# EAGLE board dt (EAGLE 9.6.2)
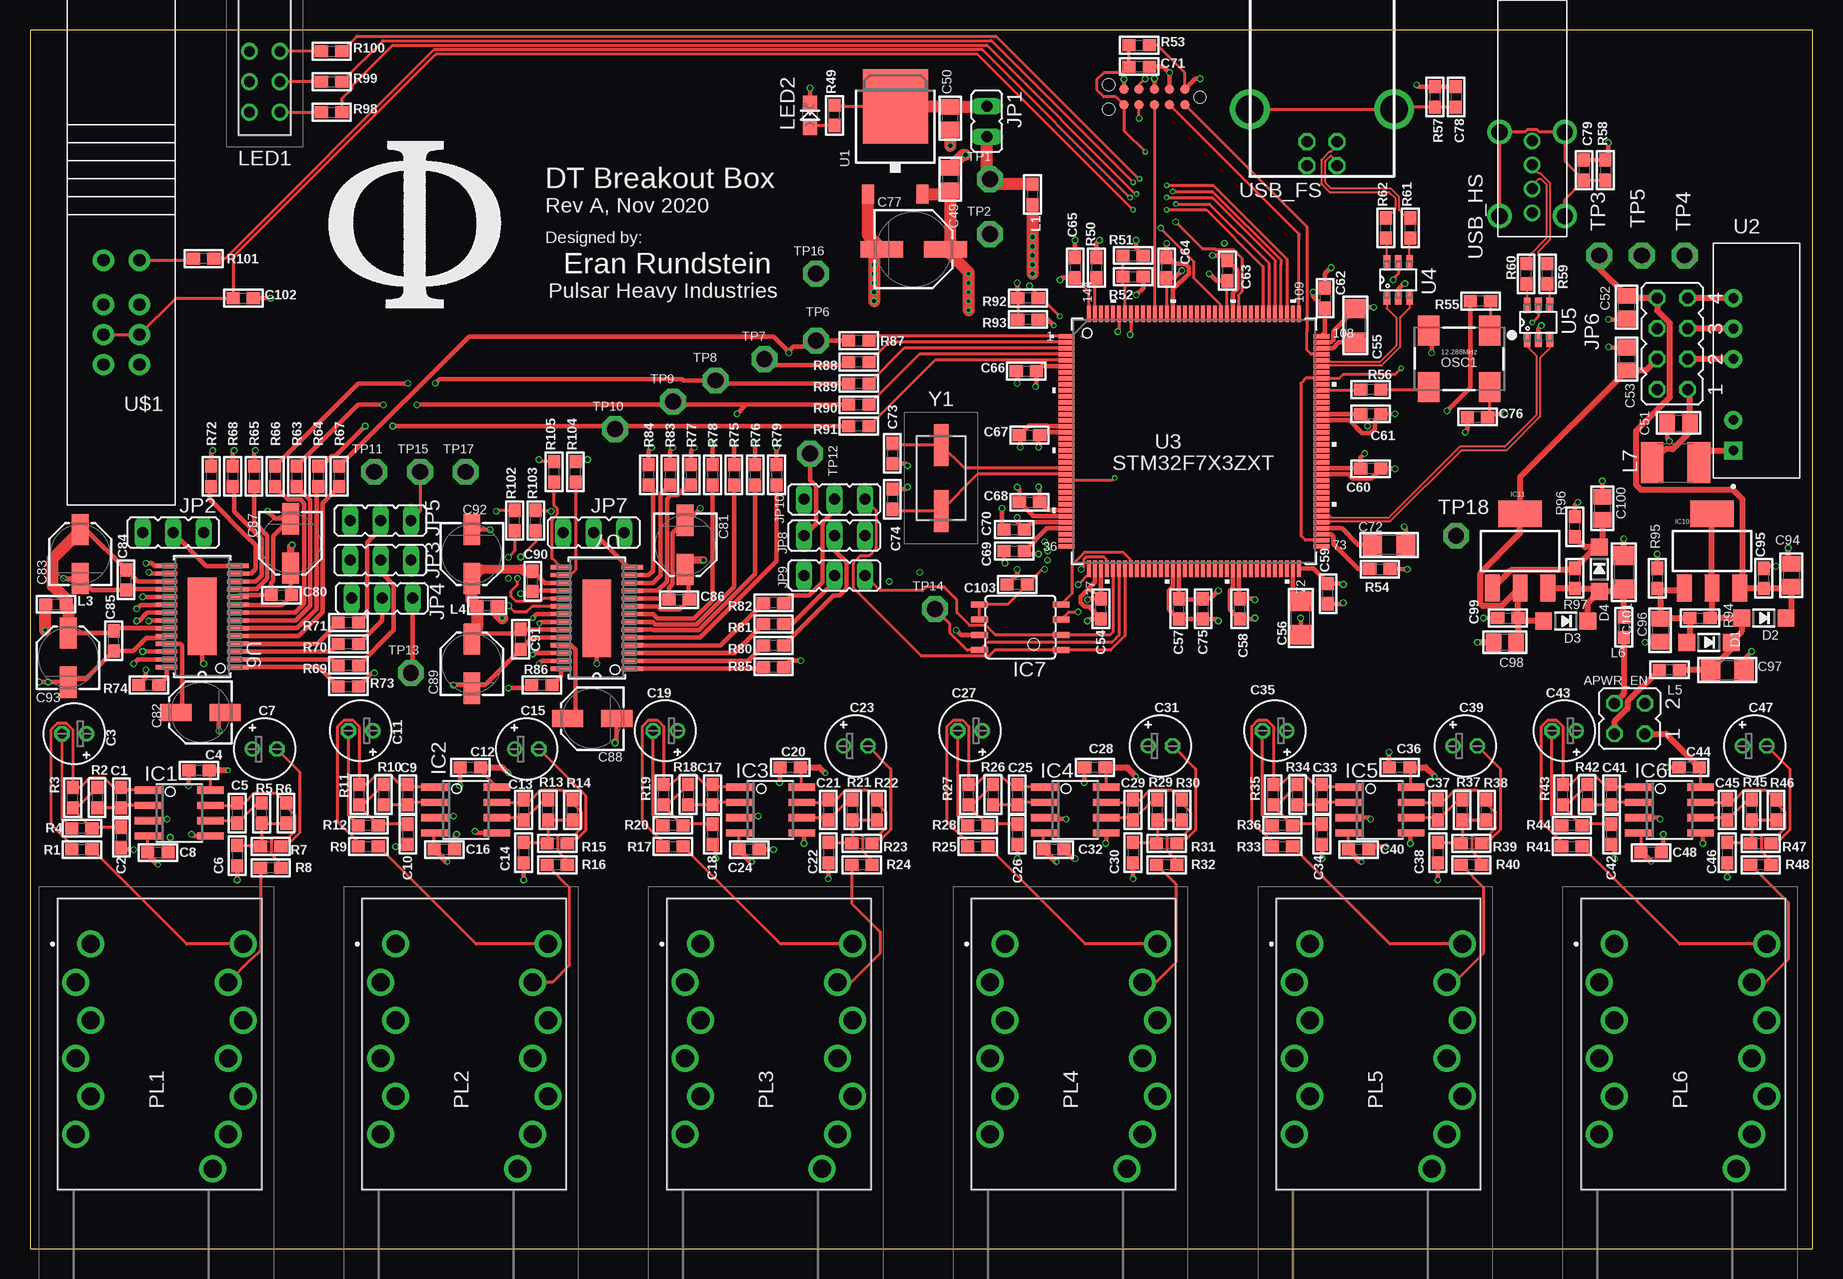
[diagram p4: board, top side]
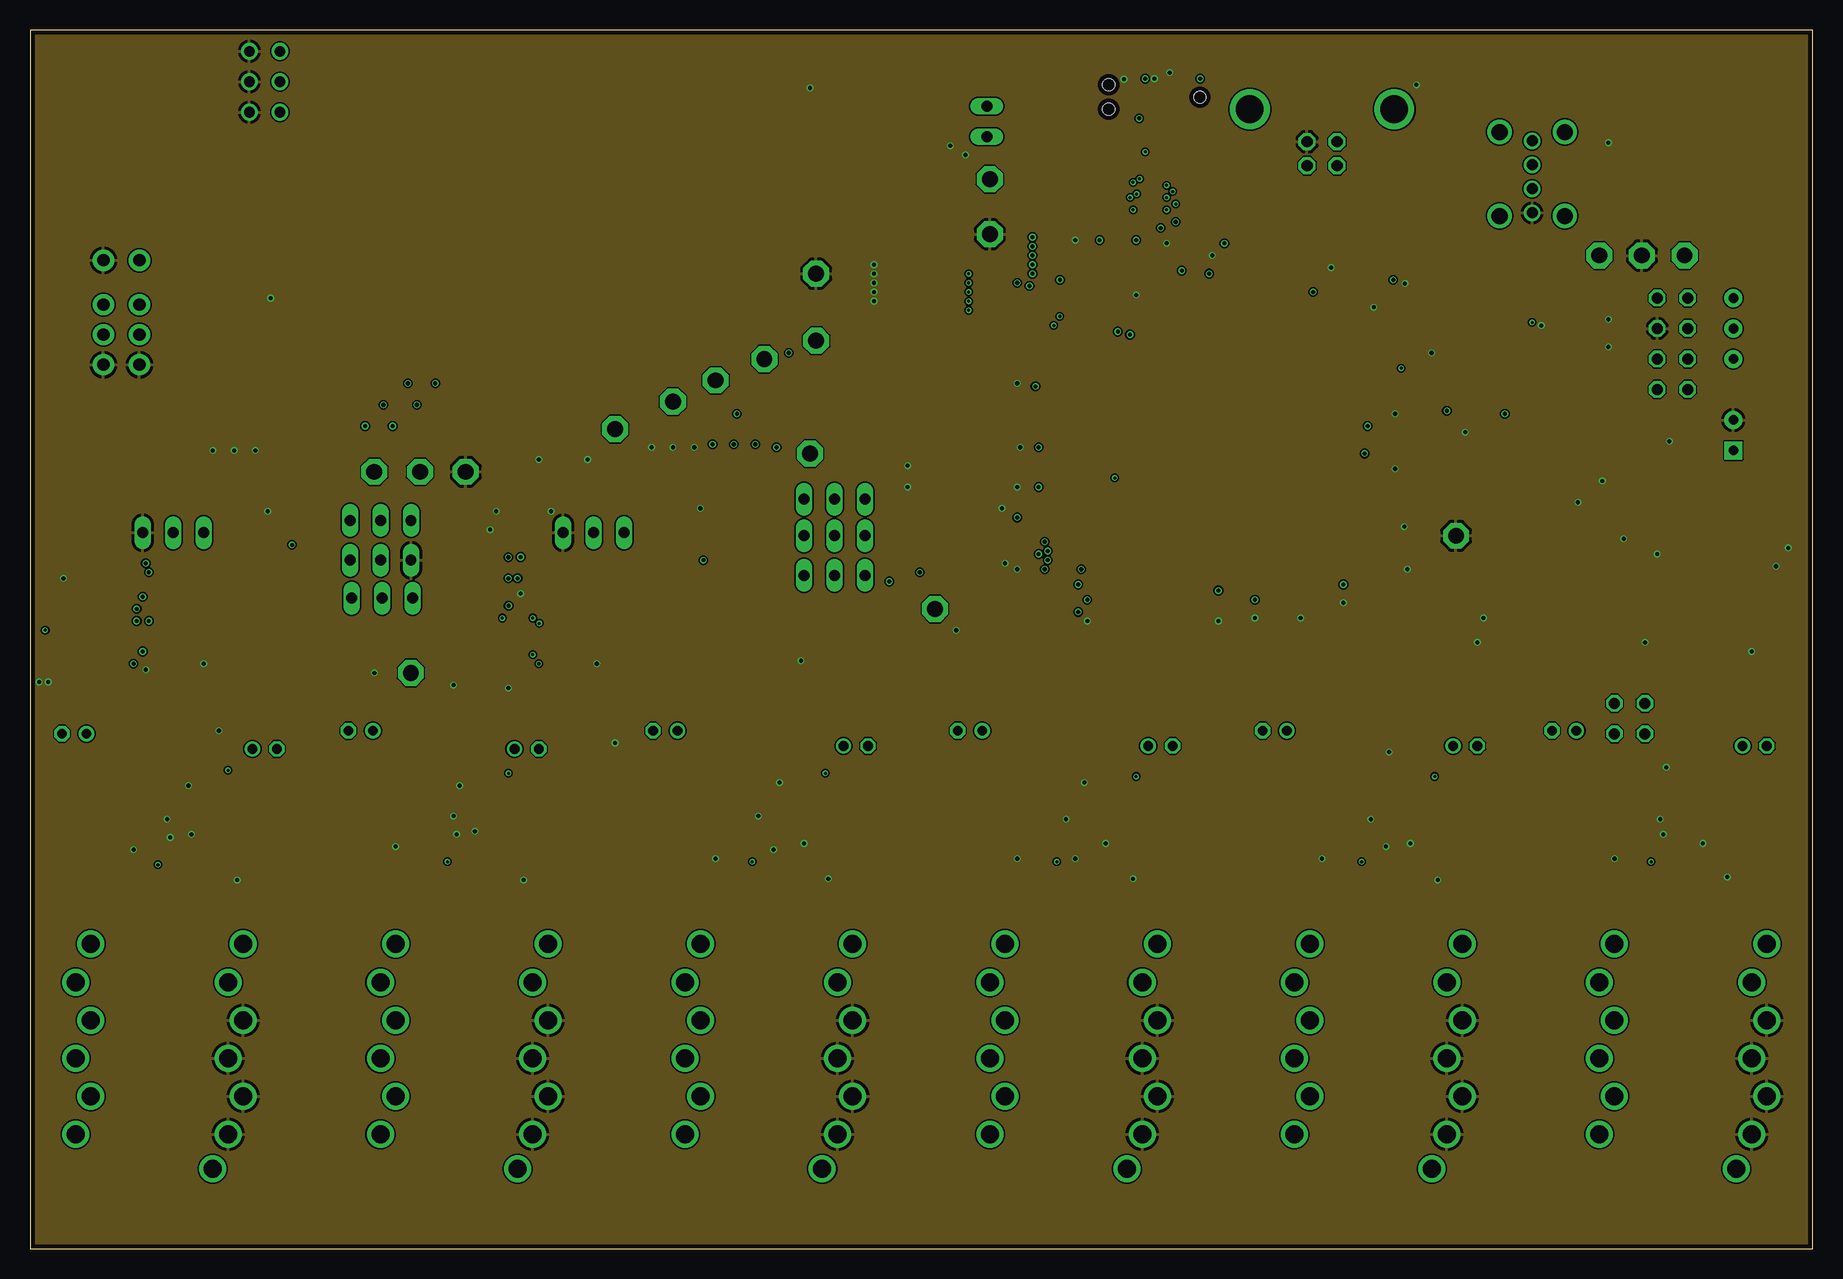
[diagram p5: board, inner layer Route2]
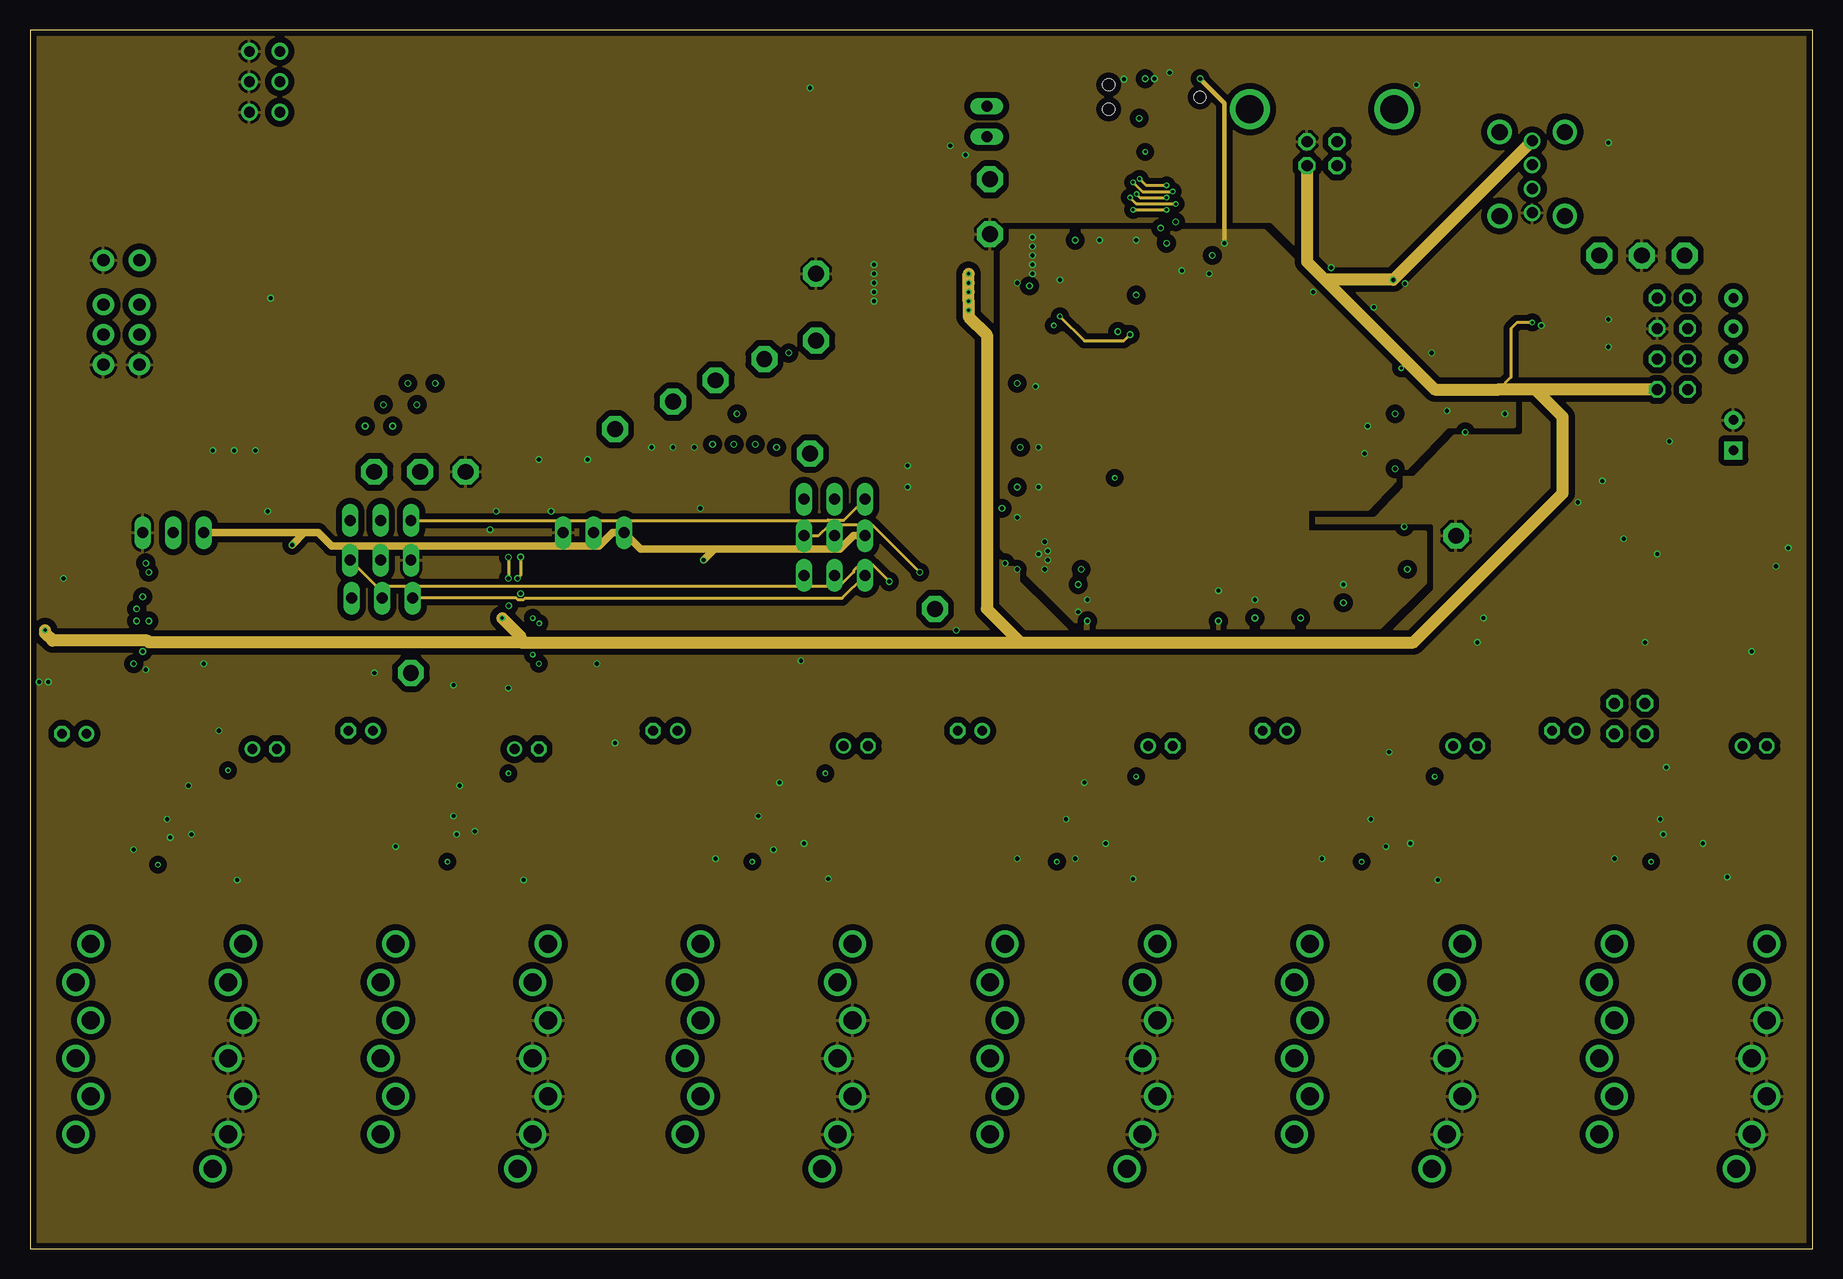
[diagram p6: board, inner layer Route15]
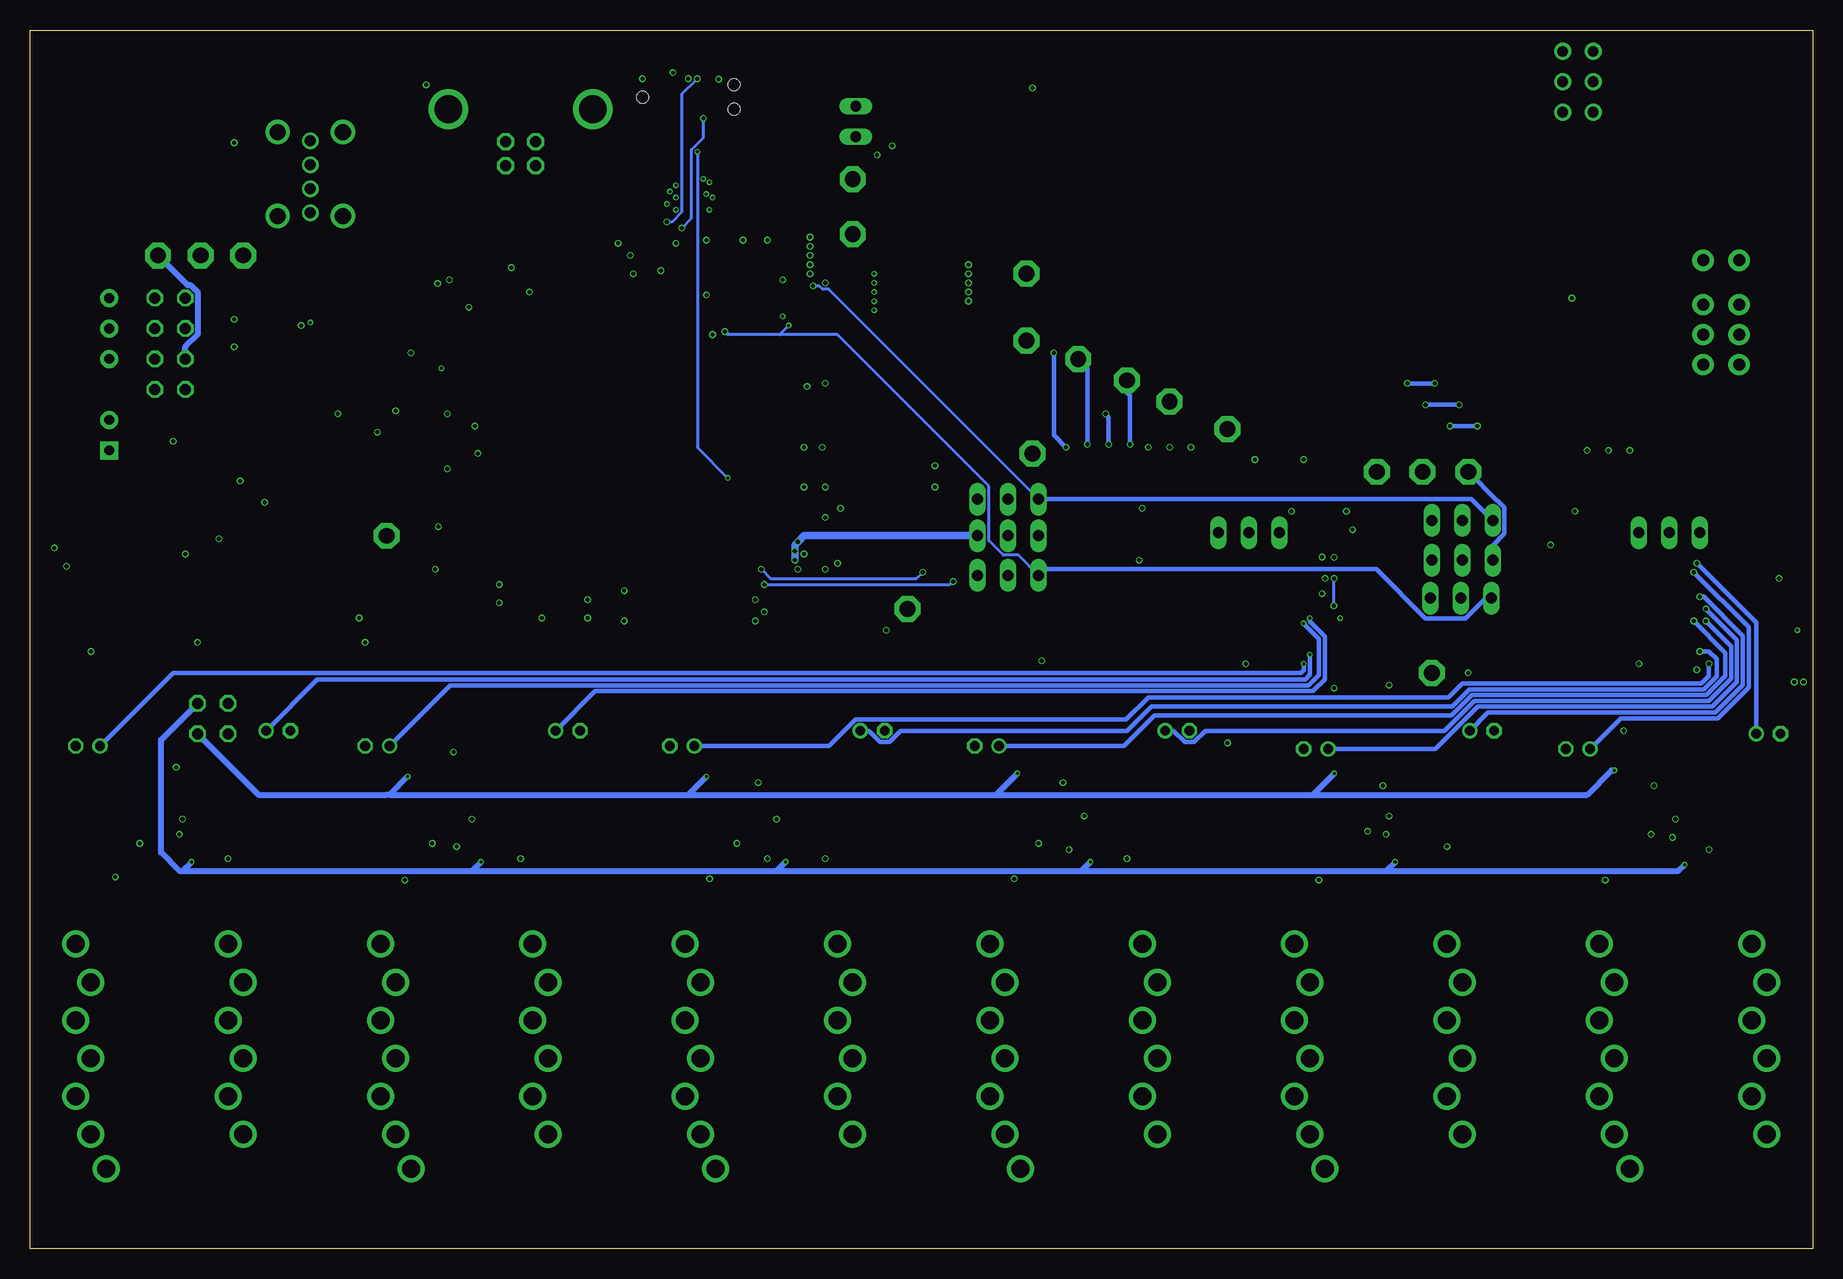
[diagram p7: board, bottom side, seen from below]

Size 148.59 x 101.6 mm. Coordinates in mm from the lower left corner, seen from the top.
Outline: 0,0 148.59,0 148.59,101.6 0,101.6 0,0
Copper layers (1+2*15+16): Top 0.035559375mm / dielectric 0.17018125mm / Route2 0.01778125mm / dielectric 47mil / Route15 0.01778125mm / dielectric 0.17018125mm / Bottom 0.035559375mm
Design rules "oshpark-4layer *": minimum track width 5mil, minimum drill 10mil, track to track 5mil, track to pad 5mil, pad to pad 5mil, via to via 5mil, smd to smd 5mil, copper to edge 15mil, drill to drill 6mil, minimum pad ring 4mil, minimum via ring 4mil, stop-mask expansion 1.5mil, vias tented up to drill 20mil, thermal gap 10mil
Net classes: 1 USB: width 0.152 mm, clearance 0.152 mm

## Footprints (pad centres in the part's own frame; a part is rotated, then mirrored left to right if it is on the bottom)
JP2Q = drill 0.914 octagon: 1 -1.27,-1.27; 2 -1.27,1.27; 3 1.27,-1.27; 4 1.27,1.27
0603 = smd 1.1 x 1: 1 -0.85,0; 2 0.85,0
E2-5 = drill 0.813 pad 1.27: + -1.016,0 | drill 0.813 pad 1.27 octagon: - 1.016,0
0805 = smd 1.3 x 1.5: 1 -0.95,0; 2 0.95,0
1206 = smd 1.6 x 1.8: 1 -1.4,0; 2 1.4,0
PANASONIC_D = smd 3.556 x 1.4: + 2.654,0; - -2.654,0
PANASONIC_C = smd 2.6 x 1.4: + 2.05,0; - -2.05,0
SOD-123 = smd 1.4 x 1.4: A 1.85,0; C -1.85,0
SO08 = smd 0.6 x 2.2: 1 -1.905,-2.6; 2 -0.635,-2.6; 3 0.635,-2.6; 4 1.905,-2.6; 5 1.905,2.6; 6 0.635,2.6; 7 -0.635,2.6; 8 -1.905,2.6
SOIC8 = smd 0.5 x 1.4: 1 -1.905,-3.404; 2 -0.645,-3.404; 3 0.625,-3.404; 4 1.895,-3.404; 5 1.905,3.404; 6 0.635,3.404; 7 -0.635,3.404; 8 -1.905,3.404
SOT223 = smd 1.219 x 2.235: 1 -2.311,-3.099; 2 0,-3.099; 3 2.311,-3.099 | smd 3.6 x 2.2: 4 0,3.099
JP1 = drill 0.914 long: 1 0,-1.27; 2 0,1.27
JP2 = drill 0.914 long: 1 -2.54,0; 2 0,0; 3 2.54,0
JP4Q = drill 0.914 octagon: 1 -3.81,-1.27; 2 -3.81,1.27; 3 -1.27,-1.27; 4 -1.27,1.27; 5 1.27,-1.27; 6 1.27,1.27; 7 3.81,-1.27; 8 3.81,1.27
L1812 = smd 1.9 x 3.4: 1 -1.95,0; 2 1.95,0
WP934SALILYLGD = drill 0.889 pad 1.4: A1 5.08,2.54; A2 2.54,2.54; A3 0,2.54; C1 5.08,0; C2 2.54,0; C3 0,0
CHIPLED_0805 = smd 1.2 x 1.2: A 0,-1.05; C 0,1.05
OSC_7X5MM = smd 1.8 x 2.5: 1 -2.54,-2.35; 2 2.54,-2.35; 3 2.54,2.35; 4 -2.54,2.35
NSJ12HF1 = drill 1.5 pad 2.25: 1 0,0; 2 3.18,-1.27; 3 6.35,0; 4 9.53,-1.27; 5 12.7,0; 6 15.874,-1.27; 7 18.75,10.16; 8 15.874,11.43; 9 12.7,12.7; 10 9.53,11.43; 11 6.35,12.7; 12 3.18,11.43; 13 0,12.7
TC2050-IDC-NL = smd 0.787 x 0.787: 1 -2.54,-0.635; 2 -2.54,0.635; 3 -1.27,-0.635; 4 -1.27,0.635; 5 0,-0.635; 6 0,0.635; 7 1.27,-0.635; 8 1.27,0.635; 9 2.54,-0.635; 10 2.54,0.635 | hole 0.991: -3.81,0; 3.81,1.016; 3.81,-1.016
P1-13 = drill 1.321 pad 2.159 octagon: TP 0,0
TO252 = smd 1 x 1.6: 1 -2.28,-4.8; 2 2.28,-4.8 | smd 5.4 x 6.2: 3 0,2.5
CONV_PCN2-S5-D12-S = drill 0.8 pad 1.5 square: 1 0,0 | drill 0.8 pad 1.5: 2 2.54,0; 4 7.62,0; 5 10.16,0; 6 12.7,0
LQFP144-20X20MM = smd 1.346 x 0.356: 1 -10.625,8.75; 2 -10.625,8.25; 3 -10.625,7.75; 4 -10.625,7.25; 5 -10.625,6.75; 6 -10.625,6.25; 7 -10.625,5.75; 8 -10.625,5.25; 9 -10.625,4.75; 10 -10.625,4.25; 11 -10.625,3.75; 12 -10.625,3.25; 13 -10.625,2.75; 14 -10.625,2.25; 15 -10.625,1.75; 16 -10.625,1.25; 17 -10.625,0.75; 18 -10.625,0.25; 19 -10.625,-0.25; 20 -10.625,-0.75; 21 -10.625,-1.25; 22 -10.625,-1.75; 23 -10.625,-2.25; 24 -10.625,-2.75; 25 -10.625,-3.25; 26 -10.625,-3.75; 27 -10.625,-4.25; 28 -10.625,-4.75; 29 -10.625,-5.25; 30 -10.625,-5.75; 31 -10.625,-6.25; 32 -10.625,-6.75; 33 -10.625,-7.25; 34 -10.625,-7.75; 35 -10.625,-8.25; 36 -10.625,-8.75; 73 10.625,-8.75; 74 10.625,-8.25; 75 10.625,-7.75; 76 10.625,-7.25; 77 10.625,-6.75; 78 10.625,-6.25; 79 10.625,-5.75; 80 10.625,-5.25; 81 10.625,-4.75; 82 10.625,-4.25; 83 10.625,-3.75; 84 10.625,-3.25; 85 10.625,-2.75; 86 10.625,-2.25; 87 10.625,-1.75; 88 10.625,-1.25; 89 10.625,-0.75; 90 10.625,-0.25; 91 10.625,0.25; 92 10.625,0.75; 93 10.625,1.25; 94 10.625,1.75; 95 10.625,2.25; 96 10.625,2.75; 97 10.625,3.25; 98 10.625,3.75; 99 10.625,4.25; 100 10.625,4.75; 101 10.625,5.25; 102 10.625,5.75; 103 10.625,6.25; 104 10.625,6.75; 105 10.625,7.25; 106 10.625,7.75; 107 10.625,8.25; 108 10.625,8.75 | smd 0.356 x 1.346: 37 -8.75,-10.625; 38 -8.25,-10.625; 39 -7.75,-10.625; 40 -7.25,-10.625; 41 -6.75,-10.625; 42 -6.25,-10.625; 43 -5.75,-10.625; 44 -5.25,-10.625; 45 -4.75,-10.625; 46 -4.25,-10.625; 47 -3.75,-10.625; 48 -3.25,-10.625; 49 -2.75,-10.625; 50 -2.25,-10.625; 51 -1.75,-10.625; 52 -1.25,-10.625; 53 -0.75,-10.625; 54 -0.25,-10.625; 55 0.25,-10.625; 56 0.75,-10.625; 57 1.25,-10.625; 58 1.75,-10.625; 59 2.25,-10.625; 60 2.75,-10.625; 61 3.25,-10.625; 62 3.75,-10.625; 63 4.25,-10.625; 64 4.75,-10.625; 65 5.25,-10.625; 66 5.75,-10.625; 67 6.25,-10.625; 68 6.75,-10.625; 69 7.25,-10.625; 70 7.75,-10.625; 71 8.25,-10.625; 72 8.75,-10.625; 109 8.75,10.625; 110 8.25,10.625; 111 7.75,10.625; 112 7.25,10.625; 113 6.75,10.625; 114 6.25,10.625; 115 5.75,10.625; 116 5.25,10.625; 117 4.75,10.625; 118 4.25,10.625; 119 3.75,10.625; 120 3.25,10.625; 121 2.75,10.625; 122 2.25,10.625; 123 1.75,10.625; 124 1.25,10.625; 125 0.75,10.625; 126 0.25,10.625; 127 -0.25,10.625; 128 -0.75,10.625; 129 -1.25,10.625; 130 -1.75,10.625; 131 -2.25,10.625; 132 -2.75,10.625; 133 -3.25,10.625; 134 -3.75,10.625; 135 -4.25,10.625; 136 -4.75,10.625; 137 -5.25,10.625; 138 -5.75,10.625; 139 -6.25,10.625; 140 -6.75,10.625; 141 -7.25,10.625; 142 -7.75,10.625; 143 -8.25,10.625; 144 -8.75,10.625
SOT23-6L_STM-M = smd 1.181 x 0.559: 1 -1.467,0.95; 2 -1.467,0; 3 -1.467,-0.95; 4 1.467,-0.95; 5 1.467,0; 6 1.467,0.95
PWP28_6P46X2P4-M = smd 1.778 x 0.356: 1 -2.972,4.225; 2 -2.972,3.575; 3 -2.972,2.925; 4 -2.972,2.275; 5 -2.972,1.625; 6 -2.972,0.975; 7 -2.972,0.325; 8 -2.972,-0.325; 9 -2.972,-0.975; 10 -2.972,-1.625; 11 -2.972,-2.275; 12 -2.972,-2.925; 13 -2.972,-3.575; 14 -2.972,-4.225; 15 2.972,-4.225; 16 2.972,-3.575; 17 2.972,-2.925; 18 2.972,-2.275; 19 2.972,-1.625; 20 2.972,-0.975; 21 2.972,-0.325; 22 2.972,0.325; 23 2.972,0.975; 24 2.972,1.625; 25 2.972,2.275; 26 2.972,2.925; 27 2.972,3.575; 28 2.972,4.225 | smd 2.4 x 6.46: 29 0,0
WBL2UOAGQ = drill 1.016 pad 1.778: LED+ -6.2,1.5; LED- -6.2,-1.5; P$1 -2.5,-1.5; P$2 0,-1.5; P$3 2.5,-1.5; P$4 -2.5,1.5; P$5 0,1.5; P$6 2.5,1.5
TE-292304-1 = drill 0.95 octagon: 1 1.25,4.71; 2 -1.25,4.71; 3 -1.25,2.71; 4 1.25,2.71 | drill 2.3: P$1 6.02,0; P$2 -6.02,0
FCI-73725-0110BLF = drill 1.35: M1 -2.72,-6.73; M2 2.72,0.27; M3 -2.72,0.27; M4 2.72,-6.73 | drill 0.92: P$1 0,-6; P$2 0,-4; P$3 0,-2; P$4 0,0
ABLS7M225000MHZD2YT = smd 3.5 x 1.2: 1 -2.75,0; 2 2.75,0

## Placement (x,y rotation side)
APWR_EN  [JP2Q]  133.35,44.2 90 top
C1  470pF  [0603]  7.62,37.59 270 top
C2  4700pF  [0603]  7.62,34.29 270 top
C3  100u  [E2-5]  3.68,42.93 180 top
C4  100n  [0603]  14.1,39.88 180 top
C5  470pF  [0603]  17.27,36.32 270 top
C6  4700pF  [0603]  17.27,32.77 270 top
C7  100u  [E2-5]  19.56,41.66 0 top
C8  100n  [0603]  10.67,33.02 180 top
C9  470pF  [0603]  31.5,37.85 270 top
C10  4700pF  [0603]  31.5,34.54 270 top
C11  100u  [E2-5]  27.56,43.18 180 top
C12  100n  [0603]  36.7,40.13 180 top
C13  470pF  [0603]  41.15,36.58 270 top
C14  4700pF  [0603]  41.15,33.02 270 top
C15  100u  [E2-5]  41.4,41.66 0 top
C16  100n  [0603]  34.54,33.27 180 top
C17  470pF  [0603]  56.9,37.85 270 top
C18  4700pF  [0603]  56.9,34.54 270 top
C19  100u  [E2-5]  52.96,43.18 180 top
C20  100n  [0603]  63.37,40.13 180 top
C21  470pF  [0603]  66.55,36.58 270 top
C22  4700pF  [0603]  66.55,33.02 270 top
C23  100u  [E2-5]  68.83,41.91 0 top
C24  100n  [0603]  59.94,33.27 180 top
C25  470pF  [0603]  82.3,37.85 270 top
C26  4700pF  [0603]  82.3,34.54 270 top
C27  100u  [E2-5]  78.36,43.18 180 top
C28  100n  [0603]  88.77,40.13 180 top
C29  470pF  [0603]  91.95,36.58 270 top
C30  4700pF  [0603]  91.95,33.02 270 top
C31  100u  [E2-5]  94.23,41.91 0 top
C32  100n  [0603]  85.34,33.27 180 top
C33  470pF  [0603]  107.7,37.85 270 top
C34  4700pF  [0603]  107.7,34.54 270 top
C35  100u  [E2-5]  103.76,43.18 180 top
C36  100n  [0603]  114.17,40.13 180 top
C37  470pF  [0603]  117.35,36.58 270 top
C38  4700pF  [0603]  117.35,33.02 270 top
C39  100u  [E2-5]  119.63,41.91 0 top
C40  100n  [0603]  110.74,33.27 180 top
C41  470pF  [0603]  131.83,37.85 270 top
C42  4700pF  [0603]  131.83,34.54 270 top
C43  100u  [E2-5]  127.89,43.18 180 top
C44  100n  [0603]  138.3,40.13 180 top
C45  470pF  [0603]  141.48,36.58 270 top
C46  4700pF  [0603]  141.48,33.02 270 top
C47  100u  [E2-5]  143.76,41.91 0 top
C48  100n  [0603]  135.13,33.02 180 top
C49  10u  [0805]  76.71,89.15 270 top
C50  10u  [0805]  76.71,94.23 90 top
C51  10u  [0805]  137.41,68.83 0 top
C52  10u  [0805]  133.1,78.49 90 top
C53  10u  [0805]  133.1,74.17 270 top
C54  100n  [0603]  89.28,53.34 90 top
C55  2.2u  [1206]  110.49,76.96 270 top
C56  2.2u  [1206]  105.92,52.58 90 top
C57  100n  [0603]  95.76,53.34 90 top
C58  100n  [0603]  100.84,53.34 90 top
C59  100n  [0603]  108.2,54.61 90 top
C60  100n  [0603]  111.76,65.02 180 top
C61  100n  [0603]  111.76,69.6 180 top
C62  100n  [0603]  107.95,79.25 270 top
C63  100n  [0603]  99.82,81.53 270 top
C64  100n  [0603]  94.74,81.79 270 top
C65  100n  [0603]  87.12,81.79 270 top
C66  100n  [0603]  83.06,73.15 0 top
C67  100n  [0603]  83.31,67.82 0 top
C68  100n  [0603]  83.31,62.23 0 top
C69  100n  [0603]  82.04,58.17 0 top
C70  100n  [0603]  82.04,59.94 0 top
C71  100n  [0603]  92.46,98.55 0 top
C72  2.2u  [1206]  113.28,58.67 180 top
C73  18pF  [0603]  71.88,66.29 270 top
C74  18pF  [0603]  71.88,62.48 270 top
C75  4.7u  [0603]  97.79,53.34 90 top
C76  100n  [0603]  120.65,69.34 0 top
C77  100u  [PANASONIC_D]  73.66,83.31 0 top
C78  4700pF  [0603]  118.87,96.01 270 top
C79  4700pF  [0603]  129.54,89.92 270 top
C80  1u Ceramic  [0603]  20.95,54.48 0 top
C81  10u Electrolyte  [PANASONIC_C]  54.61,58.67 270 top
C82  10u Electrolyte  [PANASONIC_C]  14.22,44.7 180 top
C83  10u Electrolyte  [PANASONIC_C]  4.19,57.91 90 top
C84  1u Ceramic  [0603]  8,55.75 90 top
C85  1u Ceramic  [0603]  6.99,50.67 90 top
C86  1u Ceramic  [0603]  54.1,54.1 0 top
C87  10u Electrolyte  [PANASONIC_C]  21.72,58.8 270 top
C88  10u Electrolyte  [PANASONIC_C]  46.86,44.2 180 top
C89  10u Electrolyte  [PANASONIC_C]  36.83,48.77 90 top
C90  1u Ceramic  [0603]  41.91,55.63 90 top
C91  1u Ceramic  [0603]  40.89,50.8 90 top
C92  10u Electrolyte  [PANASONIC_C]  36.83,57.91 270 top
C93  10u Electrolyte  [PANASONIC_C]  3.17,49.28 90 top
C94  2.2u  [0805]  146.81,56.13 270 top
C95  100n  [0603]  144.53,55.88 90 top
C96  10u  [0805]  135.89,51.56 270 top
C97  1u  [1206]  141.48,48.26 0 top
C98  2.2u  [0805]  122.94,50.55 180 top
C99  100n  [0603]  123.19,52.58 0 top
C100  10u  [0805]  131.06,61.72 270 top
C101  1u  [1206]  132.84,56.39 270 top
C102  100n  [0603]  17.78,79.25 0 top
C103  100n  [0603]  82.3,55.37 180 top
D1  MBR120LSFT3G  [SOD-123]  139.95,50.55 180 top
D2  MBR120LSFT3G  [SOD-123]  144.53,52.58 180 top
D3  MBR120LSFT3G  [SOD-123]  128.02,52.32 180 top
D4  MBR120LSFT3G  [SOD-123]  130.81,56.64 270 top
IC1  TL072D  [SO08]  12.45,36.32 270 top
IC2  TL072D  [SO08]  36.32,36.58 270 top
IC3  TL072D  [SO08]  61.72,36.58 270 top
IC4  TL072D  [SO08]  87.12,36.58 270 top
IC5  TL072D  [SO08]  112.52,36.58 270 top
IC6  TL072D  [SO08]  136.65,36.58 270 top
IC7  AT45DB161D-SU  [SOIC8]  82.55,51.82 90 top
IC10  LM317  [SOT223]  140.21,58.17 0 top
IC11  LM337  [SOT223]  124.21,58.17 0 top
JP1  [JP1]  79.76,93.98 180 top
JP2  [JP2]  11.94,59.69 0 top
JP3  [JP2]  29.21,57.4 0 top
JP4  [JP2]  29.34,54.23 180 top
JP5  [JP2]  29.21,60.71 180 top
JP6  [JP4Q]  136.91,75.44 90 top
JP7  [JP2]  46.99,59.69 0 top
JP8  [JP2]  67.06,59.44 0 top
JP9  [JP2]  67.06,56.13 180 top
JP10  [JP2]  67.06,62.48 180 top
L1  600ohm @ 100MHz  [0603]  83.57,87.88 270 top
L3  600ohm @ 100MHz  [0603]  2.16,53.72 0 top
L4  600ohm @ 100MHz  [0603]  38.1,53.59 180 top
L5  600ohm @ 100MHz  [0603]  136.65,48.26 180 top
L6  600ohm @ 100MHz  [0603]  132.84,51.82 270 top
L7  5.6uH  [L1812]  137.16,65.53 0 top
LED1  WP934SA_LILYLGDLED  [WP934SALILYLGD]  18.29,99.82 270 top
LED2  [CHIPLED_0805]  65.02,94.49 0 top
OSC1  12.288MHz  [OSC_7X5MM]  119.13,74.17 180 top
PL1  NSJ12HC  [NSJ12HF1]  5.08,25.4 270 top
PL2  NSJ12HC  [NSJ12HF1]  30.48,25.4 270 top
PL3  NSJ12HC  [NSJ12HF1]  55.88,25.4 270 top
PL4  NSJ12HC  [NSJ12HF1]  81.28,25.4 270 top
PL5  NSJ12HC  [NSJ12HF1]  106.68,25.4 270 top
PL6  NSJ12HC  [NSJ12HF1]  132.08,25.4 270 top
R1  47  [0603]  4.32,33.27 0 top
R2  560  [0603]  5.59,37.59 270 top
R3  8.2k  [0603]  3.56,37.59 90 top
R4  5.1k  [0603]  4.32,35.05 180 top
R5  560  [0603]  19.3,36.32 90 top
R6  8.2k  [0603]  21.34,36.32 90 top
R7  5.1k  [0603]  20.07,33.53 0 top
R8  47  [0603]  20.07,31.75 180 top
R9  47  [0603]  28.19,33.53 0 top
R10  560  [0603]  29.46,37.85 270 top
R11  8.2k  [0603]  27.43,37.85 90 top
R12  5.1k  [0603]  28.19,35.31 180 top
R13  560  [0603]  43.18,36.58 90 top
R14  8.2k  [0603]  45.21,36.58 90 top
R15  5.1k  [0603]  43.94,33.78 0 top
R16  47  [0603]  43.94,32 180 top
R17  47  [0603]  53.59,33.53 0 top
R18  560  [0603]  54.86,37.85 270 top
R19  8.2k  [0603]  52.83,37.85 90 top
R20  5.1k  [0603]  53.59,35.31 180 top
R21  560  [0603]  68.58,36.58 90 top
R22  8.2k  [0603]  70.61,36.58 90 top
R23  5.1k  [0603]  69.34,33.78 0 top
R24  47  [0603]  69.34,32 180 top
R25  47  [0603]  78.99,33.53 0 top
R26  560  [0603]  80.26,37.85 270 top
R27  8.2k  [0603]  78.23,37.85 90 top
R28  5.1k  [0603]  78.99,35.31 180 top
R29  560  [0603]  93.98,36.58 90 top
R30  8.2k  [0603]  96.01,36.58 90 top
R31  5.1k  [0603]  94.74,33.78 0 top
R32  47  [0603]  94.74,32 180 top
R33  47  [0603]  104.39,33.53 0 top
R34  560  [0603]  105.66,37.85 270 top
R35  8.2k  [0603]  103.63,37.85 90 top
R36  5.1k  [0603]  104.39,35.31 180 top
R37  560  [0603]  119.38,36.58 90 top
R38  8.2k  [0603]  121.41,36.58 90 top
R39  5.1k  [0603]  120.14,33.78 0 top
R40  47  [0603]  120.14,32 180 top
R41  47  [0603]  128.52,33.53 0 top
R42  560  [0603]  129.79,37.85 270 top
R43  8.2k  [0603]  127.76,37.85 90 top
R44  5.1k  [0603]  128.52,35.31 180 top
R45  560  [0603]  143.51,36.58 90 top
R46  8.2k  [0603]  145.54,36.58 90 top
R47  5.1k  [0603]  144.27,33.78 0 top
R48  47  [0603]  144.27,32 180 top
R49  1k  [0603]  67.06,94.49 90 top
R50  10k  [0603]  88.9,81.79 270 top
R51  10k  [0603]  91.95,82.8 0 top
R52  10k  [0603]  91.95,81.03 0 top
R53  10k  [0603]  92.46,100.33 0 top
R54  3k 1%  [0603]  112.52,56.64 0 top
R55  10k  [0603]  120.9,78.99 180 top
R56  0  [0603]  111.76,71.63 180 top
R57  1M  [0603]  117.09,96.01 270 top
R58  1M  [0603]  131.32,89.92 270 top
R59  0  [0603]  126.49,81.28 90 top
R60  0  [0603]  124.71,81.28 90 top
R61  0  [0603]  115.06,85.09 90 top
R62  0  [0603]  113.03,85.09 90 top
R63  0  [0603]  22.23,64.39 270 top
R64  0  [0603]  24,64.39 270 top
R65  22  [0603]  18.67,64.39 270 top
R66  0  [0603]  20.45,64.39 270 top
R67  0  [0603]  25.78,64.39 270 top
R68  22  [0603]  16.89,64.39 270 top
R69  0  [0603]  26.54,48.64 180 top
R70  0  [0603]  26.54,50.42 180 top
R71  0  [0603]  26.54,52.2 180 top
R72  22  [0603]  15.11,64.39 270 top
R73  22  [0603]  26.54,46.86 0 top
R74  22  [0603]  9.91,46.99 180 top
R75  0  [0603]  58.67,64.52 270 top
R76  0  [0603]  60.45,64.52 270 top
R77  22  [0603]  55.12,64.52 270 top
R78  0  [0603]  56.9,64.52 270 top
R79  0  [0603]  62.23,64.52 270 top
R80  0  [0603]  61.98,50.29 180 top
R81  0  [0603]  61.98,52.07 180 top
R82  0  [0603]  61.98,53.85 180 top
R83  22  [0603]  53.34,64.52 270 top
R84  22  [0603]  51.56,64.52 270 top
R85  22  [0603]  61.98,48.51 0 top
R86  22  [0603]  42.67,46.99 180 top
R87  22  [0603]  69.09,75.69 180 top
R88  22  [0603]  69.09,73.91 180 top
R89  22  [0603]  69.09,72.14 180 top
R90  22  [0603]  69.09,70.36 180 top
R91  22  [0603]  69.09,68.58 180 top
R92  4.7k  [0603]  83.19,79.25 180 top
R93  4.7k  [0603]  83.19,77.47 180 top
R94  240 0.1%  [0603]  139.19,52.58 0 top
R95  2.2k 0.1%  [0603]  135.64,55.88 270 top
R96  2.2k 0.1%  [0603]  128.78,60.2 90 top
R97  240 0.1%  [0603]  128.78,55.88 90 top
R98  1k  [0603]  25.15,94.74 0 top
R99  1k  [0603]  25.15,97.28 0 top
R100  1k  [0603]  25.15,99.82 0 top
R101  1k  [0603]  14.48,82.55 180 top
R102  1k  [0603]  40.39,60.71 90 top
R103  1k  [0603]  42.16,60.71 90 top
R104  1k  [0603]  45.47,64.77 90 top
R105  1k  [0603]  43.69,64.77 90 top
TC1  TC2050-IDC-NL  [TC2050-IDC-NL]  93.73,96.01 180 top
TP1  TPPAD1-13  [P1-13]  80.01,89.15 0 top
TP2  TPPAD1-13  [P1-13]  80.01,84.58 0 top
TP3  TPPAD1-13  [P1-13]  130.81,82.8 90 top
TP4  TPPAD1-13  [P1-13]  137.92,82.8 90 top
TP5  TPPAD1-13  [P1-13]  134.37,82.8 90 top
TP6  TPPAD1-13  [P1-13]  65.53,75.69 0 top
TP7  TPPAD1-13  [P1-13]  61.21,74.17 0 top
TP8  TPPAD1-13  [P1-13]  57.15,72.39 0 top
TP9  TPPAD1-13  [P1-13]  53.59,70.61 0 top
TP10  TPPAD1-13  [P1-13]  48.77,68.33 0 top
TP11  TPPAD1-13  [P1-13]  28.7,64.77 0 top
TP12  TPPAD1-13  [P1-13]  65.02,66.29 0 top
TP13  TPPAD1-13  [P1-13]  31.75,48.01 0 top
TP14  TPPAD1-13  [P1-13]  75.44,53.34 0 top
TP15  TPPAD1-13  [P1-13]  32.51,64.77 0 top
TP16  TPPAD1-13  [P1-13]  65.53,81.28 0 top
TP17  TPPAD1-13  [P1-13]  36.32,64.77 0 top
TP18  TPPAD1-13  [P1-13]  118.87,59.44 0 top
U1  LM1117DTX-3.3  [TO252]  72.14,92.71 0 top
U2  PCN2-S5-D15-S  [CONV_PCN2-S5-D12-S]  141.99,66.55 90 top
U3  STM32F7X3ZXT  [LQFP144-20X20MM]  97.03,67.31 0 top
U4  USBLC6-2SC6YSOT23-6L_STM-M  [SOT23-6L_STM-M]  114.05,80.77 90 top
U5  USBLC6-2SC6YSOT23-6L_STM-M  [SOT23-6L_STM-M]  125.73,77.22 90 top
U6  PCM1681PWPPWP28_6P46X2P4-M  [PWP28_6P46X2P4-M]  14.35,52.7 180 top
U7  PCM1681PWPPWP28_6P46X2P4-M  [PWP28_6P46X2P4-M]  47.24,52.58 180 top
U$1  WBL2UOAGQR05CLR  [WBL2UOAGQ]  7.62,76.2 270 top
U$2  PHI-LOGO  [PHI-LOGO]  32.51,86.11 90 top
USB_FS  [TE-292304-1]  107.7,95 180 top
USB_HS  FCI-73725-0110BLF  [FCI-73725-0110BLF]  125.22,86.36 180 top
Y1  ABLS7M2-25.000MHZ-D2Y-T  [ABLS7M225000MHZD2YT]  75.95,64.26 270 top

## Tracks (layer width: path | path; a pad name or v marks a point on that pad's centre or on a via)
+3V3  (via drill 0.35)
  Top 0.254: U3.121 99.78,80.64 C63.2 | U3.131 94.78,80.9 C64.2 | U3.144 88.28,79.78 C65.2 | TC1.1 96.27,98.04 93.98,100.33 R53.2 | OSC1.4 121.67,69.51 C76.2 | R92.2 R93.2 | IC7.6 IC7.5 81.5,53.72 C103.1 84.42,56.64 v84.58,56.64 | IC7.3 86.6,53.09 v87.38,53.09
  Top 0.356: C64.2 95.42,80.94 v96.01,81.53 | C63.2 98.89,80.68 v98.3,81.28 | v106.96,79.76 106.93,79.73 106.93,79.41 C62.2 107.95,76.36 U3.108 | R51.2 92.2,83.4 v92.2,84.07 | R50.1 88.9,83.82 v89.15,84.07 | C65.2 86.02,80.94 v85.85,80.77 | R92.2 82.3,79.29 v82.3,80.52 | U3.6 84.32,73.56 C66.2 83.91,71.97 v83.82,71.88 | U3.17 84.4,68.06 C67.2 84.07,67.73 v84.07,66.8 | U3.30 84.83,61.56 C68.2 84.16,63.41 v84.07,63.5 | U3.32 83.51,60.56 C70.2 82.3,60.54 v82.3,60.96 | U3.33 84.79,60.06 C69.2 83.15,57.91 v84.07,57.91 | U3.39 C54.2 88.23,54.19 v88.14,54.1 | U3.52 95.78,54.21 | 95.78,54.21 C57.2 | U3.62 100.78,54.25 C58.2 102.02,54.19 v102.11,54.1 | 95.78,54.21 95.89,54.1 97.7,54.1 C75.2 98.39,54.19 v99.06,54.86 | U3.72 106.98,56.69 C59.2 109.39,55.46 v109.47,55.37 | U3.86 110.87,65.06 C60.2 110.91,65.95 v111.25,66.29 | U3.95 107.67,69.58 108.45,69.58 108.47,69.6 C61.2 111.51,69 v111.51,68.58 | C76.2 121.75,69.6 v122.94,69.6 | R55.2 120.05,71.79 v118.11,69.85 | TC1.1 97.16,97.54 v97.54,97.54 | U6.9 19.43,53.68 21,53.68 C80.2 21.72,54.57 C87.+ | U7.9 52.32,53.55 52.58,53.3 54.15,53.3 C86.2 54.88,54.17 54.88,56.9 54.88,57.4
  Top 0.61: C81.+ 54.88,56.9 | 54.88,57.4 v56.13,57.4 | C87.+ 21.72,58.55 v21.84,58.67
  Top 1.016: L1.2 v83.57,84.33 v83.57,83.57 v83.57,82.8 v83.57,82.04 v83.57,81.28
  Route15 0.356: v97.54,97.54 99.57,95.5 v99.57,83.82
  Route15 0.61: JP8.3 68.64,59.44 67.52,58.32 57.05,58.32 | 57.05,58.32 50.9,58.32 JP7.3 48.57,59.69 47.45,58.57 25.15,58.57 24.03,59.69 22.86,59.69 | v56.13,57.4 57.05,58.32 | JP2.3 22.86,59.69 | v21.84,58.67 22.86,59.69
  Bottom 0.61: JP8.3 84.07,59.44 v84.58,58.93 84.84,58.67 v84.84,58.17 v84.84,57.4
  pour Route15 (isolate 0.508): 81.03,84.84 81.03,58.42 87.63,51.82 112.52,51.82 116.25,55.55 116.25,59.69 106.43,59.69 106.43,61.72 111.51,61.72 112.01,62.23 118.11,68.58 123.7,68.58 123.7,70.61 117.09,70.61 102.87,84.84
+5V  (via drill 0.25, 0.35)
  Top 0.254: U5.5 125.73,77.72 v125.22,77.22 | v114.3,73.41 113.79,72.9 109.46,72.9 109.12,72.56 U3.101 106.34,72.56 105.92,72.14 105.92,59.44 106.29,59.06 U3.74 | U4.5 114.05,81.28 113.79,81.03 113.79,80.93 v113.63,80.77
  Top 1.016: U1.2 76.41,87.91 C49.2 76.71,83.71 C77.+ 78.23,81.39 v78.23,81.28 v78.23,80.52 v78.23,79.76 v78.23,78.99 v78.23,78.23 | v1.27,51.56 1.27,53.68 L3.1 | L4.1 38.95,53 v39.37,52.58
  Route15 0.254: v125.22,77.22 123.95,77.22 123.44,76.71 123.44,72.64 122.43,71.63 | v114.3,73.41 114.81,73.91
  Route15 1.016: v78.23,78.99 v78.23,78.23 | v78.23,78.99 v78.23,79.76 v78.23,80.52 v78.23,81.28 | JP6.2 125.48,71.63 | 125.48,71.63 122.43,71.63 117.09,71.63 114.81,73.91 107.95,80.77 | USB_HS.P$1 v113.63,80.77 107.95,80.77 | v1.27,51.56 1.27,51.31 1.88,50.7 9.78,50.7 9.93,50.55 40.89,50.55 | v39.37,52.58 40.89,51.05 40.89,50.55 | 40.89,50.55 82.55,50.55 | 82.55,50.55 115.32,50.55 127.76,62.99 127.76,69.34 125.48,71.63 | v78.23,78.99 78.23,77.72 79.76,76.2 79.76,53.34 82.55,50.55 | 107.95,80.77 106.45,82.28 USB_FS.1
+12V  (via drill 0.25)
  Top 0.254: IC1.8 15.05,39.78 C4.1 | IC2.8 37.55,39.85 C12.1 | IC3.8 64.32,40.03 C20.1 | IC4.8 89.72,40.03 C28.1 | IC5.8 115.12,40.03 C36.1 | IC6.8 139.25,40.03 C44.1
  Top 0.508: APWR_EN.1 136.36,42.93 137.65,41.64 C44.1 | v16.51,39.88 C4.1 | C12.1 39.37,40.13 v39.88,39.62 | C20.1 65.79,40.13 v66.29,39.62 | C28.1 91.44,40.13 v92.2,39.37 | C36.1 116.33,40.13 v117.09,39.37
  Bottom 0.508: APWR_EN.1 129.54,37.85 118.87,37.85 118.62,37.85 | v16.51,39.88 16.76,39.88 18.8,37.85 41.66,37.85 | 118.62,37.85 93.73,37.85 | 93.73,37.85 68.07,37.85 | 68.07,37.85 41.66,37.85 | v39.88,39.62 41.66,37.85 | v66.29,39.62 68.07,37.85 | v92.2,39.37 93.73,37.85 | v117.09,39.37 118.62,37.85
+15V
  Top 0.508: 142.56,55.03 C95.1 146.66,55.03 C94.2 146.81,53.01 D2.C | 142.56,55.03 IC10.3 | 142.56,55.03 142.75,55.22 142.75,62.48 141.99,63.25 134.31,63.25 133.88,63.67 133.88,68.19 136.7,71.01 136.7,77.15 135.64,78.22 JP6.8 133.28,79.25 C52.2 130.81,81.72 TP3.TP
-12V  (via drill 0.25)
  Top 0.254: C32.2 84.49,34.64 IC4.4 | C40.2 109.89,34.64 IC5.4 | IC6.4 134.28,34.45 C48.2 | C24.2 59.09,34.64 IC3.4 | C16.2 33.69,34.64 IC2.4 | C8.2 9.82,34.39 IC1.4
  Top 0.508: v10.67,32 9.82,32.85 C8.2 | C16.2 34.71,32.26 v34.8,32.26 | C24.2 60.11,32.26 v60.2,32.26 | C32.2 85.51,32.26 v85.6,32.26 | C40.2 110.91,32.26 v111,32.26 | C48.2 134.37,33.02 v135.13,32.26
  Bottom 0.508: 135.89,31.5 136.14,31.5 137.67,33.02 137.67,42.42 APWR_EN.3 | 135.89,31.5 111.76,31.5 | 111.76,31.5 86.36,31.5 | 86.36,31.5 60.96,31.5 | 60.96,31.5 35.56,31.5 | 35.56,31.5 11.18,31.5 v10.67,32 | v34.8,32.26 35.56,31.5 | v60.2,32.26 60.96,31.5 | v85.6,32.26 86.36,31.5 | v111,32.26 111.76,31.5 | v135.13,32.26 135.89,31.5
-15V
  Top 0.508: IC11.2 124.16,55.07 124.04,54.95 | 124.04,54.95 122.66,53.57 121.13,53.57 120.9,53.79 120.9,56.34 124.21,59.65 IC11.4 124.21,64.33 C53.2 134.69,73.22 JP6.4 | C99.2 124.04,54.95 | D3.A 124.29,52.32 C99.2 | C99.2 124.04,50.7 C98.1
  Bottom 0.508: JP6.4 135.64,75.2 134.57,76.27 134.57,79.69 135.19,80.31 135.43,80.31 TP4.TP
DAC_OUT1  (via drill 0.35)
  Top 0.356: U6.15 10.38,56.93 10.16,57.15 v9.65,57.15
  Bottom 0.356: v9.65,57.15 4.7,52.2 C3.+
DAC_OUT2  (via drill 0.35)
  Top 0.356: U6.16 10.01,56.28 v9.91,56.39
  Bottom 0.356: C7.+ 15.98,44.22 7.9,44.22 5.33,46.79 5.33,51.82 v9.91,56.39
DAC_OUT3  (via drill 0.35)
  Top 0.356: U6.19 9.42,54.33 v9.4,54.36
  Bottom 0.356: C11.+ 27.05,44.7 8.1,44.7 5.82,46.99 5.82,51.09 9.08,54.36 v9.4,54.36
DAC_OUT4  (via drill 0.35)
  Top 0.356: U6.20 9.23,53.68 v8.89,53.34
  Bottom 0.356: v8.89,53.34 6.3,50.75 6.3,47.24 8.36,45.19 27.9,45.19 31.43,41.66 C15.+
DAC_OUT5  (via drill 0.35)
  Top 0.356: v8.89,52.32 9.08,52.32 9.79,53.03 U6.21
  Bottom 0.356: v8.89,52.32 6.78,50.22 6.78,47.55 8.66,45.67 28.19,45.67 30.68,43.18 50.61,43.18 51.55,42.24 52.33,42.24 53.27,43.18 C19.+
DAC_OUT6  (via drill 0.35)
  Top 0.356: U6.22 9.96,52.38 v9.91,52.32
  Bottom 0.356: v9.91,52.32 7.26,49.68 7.26,47.75 8.87,46.15 27.94,46.15 28.39,46.15 30.1,44.45 54.86,44.45 57.4,41.91 C23.+
DAC_OUT7  (via drill 0.35)
  Top 0.356: U6.26 v9.4,49.78
  Bottom 0.356: v9.4,49.78 8.64,49.78 8,49.15 8,47.7 9.06,46.63 28.59,46.63 30.02,45.21 45.47,45.21 55.12,45.21 57.15,43.18 76.01,43.18 76.95,42.24 77.73,42.24 78.67,43.18 C27.+
DAC_OUT8  (via drill 0.35)
  Top 0.356: U6.27 9,49.13 v8.64,48.77
  Bottom 0.356: v8.64,48.77 8.64,47.74 9.26,47.12 29.21,47.12 30.35,45.97 55.37,45.97 57.23,44.12 79.76,44.12 81.97,41.91 C31.+
DAC_OUT9  (via drill 0.25)
  Top 0.356: U7.21 42.23,52.9 v41.91,52.58
  Bottom 0.356: v41.91,52.58 41.91,52.28 40.66,51.04 40.66,47.47 41.66,46.48 101.47,46.48 C35.+
DAC_OUT10  (via drill 0.25)
  Top 0.356: U7.22 42.6,52.25 42.43,52.09 42.42,52.09 42.42,52.11 v42.44,52.14
  Bottom 0.356: v42.44,52.14 41.15,50.84 41.15,47.83 42.02,46.97 113.56,46.97 C39.+
DAC_OUT11  (via drill 0.25)
  Top 0.356: U7.26 42.03,49.65 v41.91,49.53
  Bottom 0.356: v41.91,49.53 41.91,49.01 41.88,48.99 41.88,47.86 42.29,47.45 124.64,47.45 C43.+
DAC_OUT12  (via drill 0.25)
  Top 0.356: U7.27 42.65,49 v42.42,48.77
  Bottom 0.356: v42.42,48.77 42.42,48.26 42.67,48.01 136.65,48.01 C47.+
EXT_OUT1
  Top 0.254: PL1.13 13.04,25.4 R1.2
EXT_OUT2
  Top 0.254: PL1.12 18.31,24.02 18.35,24.02 19.22,24.89 R8.2
EXT_OUT3
  Top 0.254: PL2.13 37.17,25.4 R9.2
EXT_OUT4
  Top 0.254: R16.2 44.96,30.14 44.96,23.62 43.56,22.22 PL2.12
EXT_OUT5
  Top 0.254: PL3.13 62.57,25.4 R17.2
EXT_OUT6
  Top 0.254: R24.2 68.49,28.79 70.87,26.42 70.87,24.64 68.33,22.1 67.43,22.1 PL3.12
EXT_OUT7
  Top 0.254: PL4.13 87.97,25.4 R25.2
EXT_OUT8
  Top 0.254: R32.2 95.5,30.39 95.5,23.88 93.85,22.22 PL4.12
EXT_OUT9
  Top 0.254: PL5.13 113.37,25.4 R33.2
EXT_OUT10
  Top 0.254: R40.2 121.16,30.14 121.16,24.64 118.74,22.22 PL5.12
EXT_OUT11
  Top 0.254: PL6.13 137.5,25.4 R41.2
EXT_OUT12
  Top 0.254: R48.2 146.56,28.87 146.56,24.13 144.65,22.22 PL6.12
GND  (via drill 0.35)
  Top 0.254: R102.2 38.95,61.56 v38.86,61.47 | R103.2 43.35,61.56 v43.43,61.47 | R105.2 42.58,65.62 v42.42,65.79 | R104.2 45.63,65.79 v46.48,65.79
  Top 0.356: LED2.C v65.02,96.77 | C71.2 94.49,98.55 v95,98.04 TC1.3 | C65.1 v87.12,84.07 | R52.2 92.8,80.1 v92.2,79.5 | C64.1 94.74,82.8 | 94.74,82.8 v94.74,83.82 | U3.120 100.28,79.66 100.63,80.01 100.63,81.58 C63.1 99.4,82.8 v98.55,82.8 | U3.130 95.28,79.98 96.59,81.29 96.59,81.78 96.25,82.11 95.43,82.11 94.74,82.8 | C62.1 107.95,81.28 v108.46,81.79 | v112.01,78.49 110.61,78.49 C55.1 108.63,76.5 108.63,75.76 108.45,75.58 107.67,75.58 U3.107 | U4.2 114.05,80.01 114.55,80.52 v114.61,80.46 | OSC1.2 116.84,76.26 v116.84,74.68 | C76.1 119.8,68.24 v119.63,68.07 | U3.94 109.97,69.06 111.03,68 111.75,68 112.09,68.34 112.09,69.07 C61.1 v113.79,69.6 | U3.85 109.89,64.56 110.23,64.22 111.81,64.22 C60.1 v113.79,65.02 | C72.1 114.68,60.07 v114.55,60.2 | R54.2 v114.81,56.64 | C59.1 109.39,53.76 v109.47,53.85 | C56.1 v105.92,52.58 | U3.61 100.28,55.11 100.03,54.87 100.03,53.3 C58.1 102.02,52.49 v102.11,52.58 | U3.51 95.28,55.19 94.95,54.87 94.95,53.3 C57.1 C75.1 98.89,52.49 v99.06,52.32 | U3.38 88.78,55.56 87.56,54.34 87.56,53.86 87.9,53.52 88.25,53.52 C54.1 88.3,52.49 v88.14,52.32 | U3.31 83.63,61.06 C68.1 82.46,63.33 v82.3,63.5 | C70.1 81.03,60.11 v81.03,61.72 | C69.1 81.19,57.24 v81.28,57.15 | C103.2 82.3,56.22 v82.3,56.64 | IC7.7 77.6,51.18 v77.22,51.56 | U3.16 84.9,68.56 84.84,68.62 83.27,68.62 C67.1 82.55,67.73 v82.55,66.8 | C66.1 82.3,73.06 v82.3,72.14 | C73.2 72.99,65.44 v73.15,65.28 | C74.1 72.99,63.33 v73.15,63.5 | C52.1 133.03,77.47 v131.57,77.47 | C53.1 131.64,75.12 v131.57,75.18 | C51.1 136.46,67.5 v136.65,67.31 | C100.1 v131.06,64.01 | R96.2 128.78,61.98 v129.03,62.23 | R95.1 v135.64,57.91 | C99.1 v121.16,52.58
  Top 0.356: C95.2 144.69,56.9 v145.54,56.9 | C97.2 142.88,49.15 v143.51,49.78 | C46.2 v141.48,30.99 | IC6.5 139.45,34.48 v139.45,33.78 | C48.1 136.14,33.19 v136.14,34.54 | IC6.3 135.76,35.94 v135.89,35.81 | C42.2 132.08,33.44 v132.08,32.51 | C44.2 v136.4,40.13 | C38.2 v117.35,30.73 | IC5.5 115.06,34.61 v115.06,33.78 | C40.1 111.85,33.53 v113.03,33.53 | IC5.3 111.63,35.94 v111.76,35.81 | C36.2 113.28,40.17 v113.28,41.4 | C34.2 v107.7,32.51 | C30.2 v91.95,30.84 | IC4.5 89.72,33.84 v89.66,33.78 | C32.1 86.96,32.51 v87.12,32.51 | IC4.3 84.65,35.81 v86.36,35.81 | C28.2 87.88,40.09 v87.88,38.86 | C26.2 v82.3,32.51 | C22.2 v66.55,30.84 | IC3.5 64.52,34.48 v64.52,33.78 | IC3.3 59.25,36.07 v60.71,36.07 | C20.2 62.52,38.9 v62.48,38.86 | C24.1 v61.98,33.27 | C18.2 57.15,33.44 v57.15,32.51 | R85.2 63.33,49.02 v64.26,49.02 | C88.- 48.91,42.31 v48.77,42.16 | C14.2 v41.15,30.73 | IC2.5 37.21,34.67 v37.08,34.8 | C12.2 35.85,38.65 v35.81,38.61 | IC2.3 33.85,36.07 v35.31,36.07 | C10.2 31.33,33.53 v30.48,33.53 | C89.- 36.83,46.99 | R73.2 28.54,48.01 v28.7,48.01 | C16.1 35.39,34.38 v35.56,34.54 | C82.- 15.75,44.18 v15.75,43.18 | R74.2 9.65,47.59 v9.65,48.26 | C6.2 v17.27,30.73 | IC1.5 13.59,34.42 v13.46,34.54 | C4.2 13.25,38.65 v13.21,38.61 | IC1.3 9.97,35.81 v11.43,35.81 | C8.1 11.68,33.19 v11.68,34.29 | C2.2 7.79,33.27 v8.64,33.27 | v0.76,47.24 0.78,47.23 C93.- 3.17,47.5 4.66,47.5 C85.1 8.62,49.82 9.7,50.91 11.21,50.91 U6.24 | U6.29 14.35,48.9 v14.48,48.77 | U6.18 8.08,54.98 C84.1 5.15,54.9 C83.- 4.17,55.88 v2.79,55.88 | U5.2 125.73,76.71 v125.98,76.96 | U6.10 17.48,54.48 C80.1 20.11,55.49 20.27,55.66 20.27,59.4 C87.- 20.43,60.85 v19.81,61.47 | R65.1 18.67,66.42 v18.8,66.55
  Top 0.356: R68.1 16.89,66.42 v17.02,66.55 | R72.1 15.11,66.42 v15.24,66.55 | U7.24 41.9,50.95 C91.1 37.93,46.99 36.83,46.99 | 36.83,46.99 v35.31,46.99 | U7.18 41.99,54.85 C90.1 41.74,54.61 v40.89,54.61 | U7.29 v47.24,48.77 | U7.10 53.15,54.2 C86.1 53.25,55.11 53.57,55.43 53.57,59.68 C81.- 54.88,60.72 v55.88,61.72 | R77.1 55.12,66.55 v55.37,66.8 | R83.1 53.34,66.55 v53.59,66.8 | R84.1 51.56,66.55 v51.82,66.8 | R86.2 41.57,46.74 v39.88,46.74 | C92.- 38.34,59.96 v38.35,59.94 | C78.1 R57.1 115.74,96.86 v115.57,97.03 | C79.1 R58.1 131.57,91.02 v131.57,92.2 | TC1.5 v93.73,97.54 | TC1.9 v91.19,97.5 | C102.2 v20.07,79.25
  Top 0.508: C101.1 v132.84,59.18 | C96.2 135.82,50.55 v134.62,50.55 | C98.2 v120.65,50.55 | C94.1 146.56,57.34 v146.56,58.42
  Top 1.016: C50.1 v76.71,91.95 | C49.1 77.79,91.19 v77.98,91.19 | U1.1 69.86,84.46 C77.- 70.36,82.66 v70.36,82.04 v70.36,81.28 v70.36,80.52 v70.36,79.76 v70.36,78.99
  other vias: 1.52,47.24
  pour Route2 (rank 6): -17.78,121.67 151.38,121.67 151.38,-14.99 3.56,-14.99 -17.78,6.35
  pour Route15 (isolate 0.508, rank 6): -6.6,107.95 -6.6,-0.25 0.51,-7.37 151.64,-7.37 155.96,-3.05 155.96,106.93 151.13,111.76 -3.05,111.76 -6.86,107.95
I2C_SCL  (via drill 0.25, 0.35)
  Top 0.254: U3.139 90.78,76.55 v90.68,76.45
  Top 0.356: R93.1 84.84,77.47 v85.34,76.96
  Bottom 0.254: JP9.3 66.19,57.81 67.44,57.81 68.66,59.02 68.66,63.56 81.3,76.2 86.11,76.2 | v90.68,76.45 90.42,76.2 86.11,76.2 | v85.34,76.96 86.11,76.2
  Bottom 0.356: JP9.3 64.01,56.64 36.38,56.64 32.29,52.55 28.93,52.55 27.25,54.23 JP4.3
I2C_SDA  (via drill 0.25, 0.35)
  Top 0.254: U3.137 91.78,76.28 v91.69,76.2 | v85.85,77.72 84.33,79.25 R92.1 84.03,79.54 v83.31,80.26
  Route15 0.254: v91.69,76.2 91.19,75.69 87.88,75.69 v85.85,77.72
  Bottom 0.254: v83.31,80.26 82.79,80.26 82.52,79.99 82.02,79.99 JP10.3
  Bottom 0.356: JP10.3 28.45,62.48 JP5.3
I2S_CKIN
  Top 0.254: U3.99 110.84,71.56 R56.2
LED1  (via drill 0.25)
  Top 0.254: R98.2 26,95.87 26.8,96.68 26.8,96.9 30.23,100.33 79.76,100.33 92.2,87.88 v92.23,87.92 | v94.74,87.63 98.55,87.63 103.78,82.4 U3.113
  Route15 0.254: v92.23,87.92 92.52,87.63 v94.74,87.63
LED2  (via drill 0.25)
  Top 0.254: U3.112 104.28,82.04 104.28,82.44 98.58,88.14 v95.25,88.14 | R99.2 29.43,100.71 80.14,100.71 v91.95,88.9
  Route15 0.254: v91.95,88.9 92.71,88.14 v95.25,88.14
LED3  (via drill 0.25)
  Top 0.254: R100.2 27.27,101.09 80.52,101.09 92.46,89.15 v92.48,89.18 v92.48,89.19 | v94.74,88.65 98.61,88.65 104.78,82.48 U3.111
  Route15 0.254: v92.48,89.19 93.03,88.65 v94.74,88.65
LED4  (via drill 0.25)
  Top 0.254: v91.69,87.63 79.38,99.95 33.66,99.95 16.26,82.55 R101.1 | v95.5,87.1 98.32,87.1 103.28,82.14 U3.114
  Route15 0.254: v91.69,87.63 92.2,87.12 95.48,87.12 v95.5,87.1
N$1
  Top 0.254: IC1.2 7.83,36.96 C1.2 R2.2
N$2
  Top 0.254: IC1.1 7.83,38.23 C1.1 7,38.44 6.19,39.25 4.98,39.25 4.18,38.44 R3.2 3.56,43.29 3.04,43.81 2.3,43.81 1.78,43.29 1.78,35.33 3.47,33.64 R1.1
N$3
  Top 0.254: R2.1 3.89,36.74 R3.1 3.56,36.66 R4.1 5.26,35.14 C2.1
N$4
  Top 0.254: R4.2 2.67,35.85 C3.-
N$5
  Top 0.254: IC1.6 17.06,35.69 C5.2 18.97,37.17 R5.2
N$6
  Top 0.254: IC1.7 17.06,36.96 C5.1 17.89,37.17 18.7,37.98 20.53,37.98 R6.2 21.34,36.88 22.09,36.13 22.09,34.82 21.55,34.28 20.26,34.28 20.11,34.13 20.11,32.92 20.92,32.12 R8.1
N$7
  Top 0.254: C6.1 19.13,33.62 | 19.13,33.62 R7.1 | 19.13,33.62 19.3,33.79 R5.1 R6.1
N$8
  Top 0.254: R7.2 21.29,33.9 21.71,33.9 22.47,34.66 22.47,39.76 C7.-
N$9
  Top 0.254: IC2.2 31.71,37.21 C9.2 R10.2
N$10
  Top 0.254: IC2.1 31.71,38.48 C9.1 30.87,38.7 30.07,39.5 28.86,39.5 28.05,38.7 R11.2 27.43,43.55 26.91,44.07 26.18,44.07 25.65,43.55 25.65,35.59 27.34,33.9 R9.1
N$11
  Top 0.254: R10.1 27.76,37 R11.1 27.43,36.92 R12.1 29.13,35.39 C10.1
N$12
  Top 0.254: R12.2 26.54,36.11 C11.-
N$13
  Top 0.254: IC2.6 40.93,35.94 C13.2 42.85,37.43 R13.2
N$14
  Top 0.254: IC2.7 40.93,37.21 C13.1 41.77,37.43 42.58,38.23 44.41,38.23 R14.2 45.21,37.13 45.97,36.38 45.97,35.07 45.43,34.54 44.14,34.54 43.99,34.39 43.99,33.18 44.79,32.37 R16.1
N$15
  Top 0.254: C14.1 43,33.87 | 43,33.87 R15.1 | 43,33.87 43.18,34.05 R13.1 R14.1
N$16
  Top 0.254: R15.2 45.16,34.16 45.59,34.16 46.35,34.91 46.35,37.73 C15.-
N$17
  Top 0.254: IC3.2 57.11,37.21 C17.2 R18.2
N$18
  Top 0.254: IC3.1 57.11,38.48 C17.1 56.27,38.7 55.47,39.5 54.26,39.5 53.45,38.7 R19.2 52.83,43.55 52.31,44.07 51.58,44.07 51.05,43.55 51.05,35.59 52.74,33.9 R17.1
N$19
  Top 0.254: R18.1 53.16,37 R19.1 52.83,36.92 R20.1 54.53,35.39 C18.1
N$20
  Top 0.254: R20.2 51.94,36.11 C19.-
N$21
  Top 0.254: IC3.6 66.33,35.94 C21.2 68.25,37.43 R21.2
N$22
  Top 0.254: IC3.7 66.33,37.21 C21.1 67.17,37.43 67.97,38.23 69.81,38.23 R22.2 70.61,37.13 71.37,36.38 71.37,35.07 70.83,34.54 69.54,34.54 69.39,34.39 69.39,33.18 70.19,32.37 R24.1
N$23
  Top 0.254: C22.1 68.4,33.87 | 68.4,33.87 R23.1 | 68.4,33.87 68.58,34.05 R21.1 R22.1
N$24
  Top 0.254: R23.2 70.56,34.16 70.99,34.16 71.75,34.91 71.75,40.01 C23.-
N$25
  Top 0.254: IC4.2 82.51,37.21 C25.2 R26.2
N$26
  Top 0.254: IC4.1 82.51,38.48 C25.1 81.67,38.7 80.87,39.5 79.66,39.5 78.86,38.7 R27.2 78.23,43.55 77.71,44.07 76.97,44.07 76.45,43.55 76.45,35.59 78.14,33.9 R25.1
N$27
  Top 0.254: R26.1 78.56,37 R27.1 78.23,36.92 R28.1 79.93,35.39 C26.1
N$28
  Top 0.254: R28.2 77.34,36.11 C27.-
N$29
  Top 0.254: IC4.6 91.73,35.94 C29.2 93.65,37.43 R29.2
N$30
  Top 0.254: IC4.7 91.73,37.21 C29.1 92.57,37.43 93.38,38.23 95.21,38.23 R30.2 96.01,37.13 96.77,36.38 96.77,35.07 96.23,34.54 94.94,34.54 94.79,34.39 94.79,33.18 95.59,32.37 R32.1
N$31
  Top 0.254: C30.1 93.8,33.87 | 93.8,33.87 R31.1 | 93.8,33.87 93.98,34.05 R29.1 R30.1
N$32
  Top 0.254: R31.2 95.97,34.16 96.39,34.16 97.15,34.91 97.15,40.01 C31.-
N$33
  Top 0.254: IC5.2 107.91,37.21 C33.2 R34.2
N$34
  Top 0.254: IC5.1 107.91,38.48 C33.1 107.07,38.7 106.27,39.5 105.06,39.5 104.25,38.7 R35.2 103.63,43.55 103.11,44.07 102.38,44.07 101.85,43.55 101.85,35.59 103.54,33.9 R33.1
N$35
  Top 0.254: R34.1 103.96,37 R35.1 103.63,36.92 R36.1 105.33,35.39 C34.1
N$36
  Top 0.254: R36.2 102.74,36.11 C35.-
N$37
  Top 0.254: IC5.6 117.13,35.94 C37.2 119.05,37.43 R37.2
N$38
  Top 0.254: IC5.7 117.13,37.21 C37.1 117.97,37.43 118.78,38.23 120.61,38.23 R38.2 121.41,37.13 122.17,36.38 122.17,35.07 121.63,34.54 120.34,34.54 120.19,34.39 120.19,33.18 120.99,32.37 R40.1
N$39
  Top 0.254: C38.1 119.2,33.87 | 119.2,33.87 R39.1 | 119.2,33.87 119.38,34.05 R37.1 R38.1
N$40
  Top 0.254: R39.2 121.36,34.16 121.79,34.16 122.55,34.91 122.55,40.01 C39.-
N$41
  Top 0.254: IC6.2 132.04,37.21 C41.2 R42.2
N$42
  Top 0.254: IC6.1 132.04,38.48 C41.1 131.2,38.7 130.4,39.5 129.19,39.5 128.38,38.7 R43.2 127.76,43.55 127.24,44.07 126.5,44.07 125.98,43.55 125.98,35.59 127.67,33.9 R41.1
N$43
  Top 0.254: R42.1 128.09,37 R43.1 127.76,36.92 R44.1 129.46,35.39 C42.1
N$44
  Top 0.254: R44.2 126.87,36.11 C43.-
N$45
  Top 0.254: IC6.6 141.26,35.94 C45.2 143.18,37.43 R45.2
N$46
  Top 0.254: IC6.7 141.26,37.21 C45.1 142.1,37.43 142.91,38.23 144.74,38.23 R46.2 145.54,37.13 146.3,36.38 146.3,35.07 145.76,34.54 144.47,34.54 144.32,34.39 144.32,33.18 145.12,32.37 R48.1
N$47
  Top 0.254: C46.1 143.33,33.87 | 143.33,33.87 R47.1 | 143.33,33.87 143.51,34.05 R45.1 R46.1
N$48
  Top 0.254: R47.2 145.5,34.16 145.92,34.16 146.68,34.91 146.68,40.01 C47.-
N$49
  Top 0.254: R49.1 65.22,93.64 LED2.A
N$50
  Top 0.254: U1.3 67.18,95.21 R49.2
  Top 1.016: JP1.1 79.69,95.18 C50.2 72.16,95.18 U1.3
N$51
  Top 1.016: JP1.2 79.76,89.41 TP1.TP 80.43,88.73 L1.1
N$52
  Top 0.508: L7.2 140.13,66.55 U2.1
N$53
  Top 0.508: U2.5 JP6.5
N$54
  Top 0.508: U2.6 JP6.7
N$55
  Top 0.508: U2.4 JP6.3
N$56
  Top 0.508: JP6.1 138.36,71.44 C51.2 138.36,68.09 136.92,66.65 136.33,66.65 L7.1
N$57
  Top 0.356: U3.71 105.28,54.48 105.16,54.36 105.53,53.98 C56.2
N$58
  Top 0.356: U3.106 107.67,75.08 108.64,75.08 109.12,75.56 C55.2
N$59
  Top 0.254: U3.143 88.78,80.82 R50.2
N$60
  Top 0.254: U3.138 91.28,80.17 91.1,80.35 R52.1 R51.1
N$61
  Top 0.356: U3.75 108.44,59.56 108.63,59.36 108.63,58.76 110.74,56.64 R54.1
N$62
  Top 0.356: U3.76 109.36,60.06 110.74,58.67 C72.2
N$63
  Top 0.254: OSC1.1 121.75,76.61 R55.1
N$64
  Top 0.254: R56.1 116.4,71.63 OSC1.3
N$65
  Top 0.254: U3.1 70.31,76.06 R87.1
N$66
  Top 0.254: U3.2 71.58,75.56 R88.1
N$67
  Top 0.254: USB_FS.P$1 113.28,95 | 113.28,95 USB_FS.P$2 | C78.2 R57.2 113.45,95.16 113.28,95
N$68
  Top 0.254: U3.3 72.86,75.06 R89.1
N$69
  Top 0.254: USB_HS.M3 127.94,87.47 C79.2 | C79.2 127.94,90.66 USB_HS.M1 125.83,93.09 125.61,93.3 124.83,93.3 124.62,93.09 USB_HS.M4 USB_HS.M2 | C79.2 R58.2
N$70
  Top 0.254: U3.4 74.14,74.56 R90.1
N$71
  Top 0.254: U3.5 75.42,74.06 R91.1
N$72
  Top 0.508: L5.1 C97.1 141.8,49.99 D1.C 142.68,51.42 D2.A R94.2 140.21,52.74 IC10.2 IC10.4
N$73
  Top 0.508: IC10.1 137.69,54.86 135.8,54.86 R95.2 135.89,54.78 C96.1 135.96,52.58 R94.1 138.34,50.78 D1.A
N$74
  Top 0.508: L5.2 133.15,45.6 133.15,45.02 132.08,43.96 APWR_EN.2
N$75
  Top 0.356: U6.1 24.08,48.48 R73.1
N$76
  Top 0.356: U6.28 11.38,47.61 R74.1
N$77
  Top 0.356: U6.2 25.2,49.13 R69.2
N$78
  Top 0.356: U6.14 14.7,56.93 JP2.2
N$79
  Top 0.356: U6.25 12.56,50.43 12.7,50.29 12.7,45.23 C82.+
N$80
  Top 0.356: U6.23 7.19,51.73 C85.2 6.79,51.33 C93.+ | U6.17 8.97,55.63 C84.2 4.64,59.96 4.32,59.96 C83.+
  Top 1.016: C93.+ 3.17,53.55 L3.2 3.01,54.15 1.88,55.27 1.88,57.53 4.32,59.96
N$81
  Top 0.356: U6.7 22.15,52.38 23.37,53.59 23.37,58.42 23.37,58.67 23.37,62.4 R63.2
N$82
  Top 0.356: U6.6 22.27,51.73 23.88,53.34 23.88,63.41 R64.2
N$83
  Top 0.356: U6.11 18.91,54.98 19.79,55.85 19.79,59.46 18.67,60.58 R65.2
N$84
  Top 0.356: U6.8 22.09,53.03 22.86,53.8 22.86,62.14 22.54,62.46 21.53,62.46 R66.2
N$85
  Top 0.356: U6.12 18.8,55.63 19.3,56.13 19.3,59.18 17.02,61.47 17.02,63.41 R68.2
N$86
  Top 0.356: R72.2 14.99,63.41 14.99,62.48 18.29,59.18 18.52,58.95 18.8,58.67 18.8,56.64 18.43,56.28 U6.13
N$87
  Top 0.508: D3.C 129.87,53.85 130.72,54.7 | 130.72,54.7 D4.A 132.65,54.79 C101.2 L6.1 | IC11.3 128.74,55.07 R97.1 130.39,55.03 130.72,54.7
N$88
  Top 0.508: C100.2 131.06,58.75 D4.C | IC11.1 121.94,55.07 123.44,56.57 128.61,56.57 R97.2 130.54,58.49 D4.C | D4.C 129.63,58.49 R96.1
N$89
  Top 0.356: U6.5 22.38,51.08 24.38,53.09 24.38,62.14 R67.2
N$90
  Top 0.508: L6.2 132.84,46.23 APWR_EN.4
N$91
  Top 0.356: U6.3 25.05,49.78 R70.2
N$92
  Top 0.356: U6.4 23.93,50.43 R71.2
N$93
  Top 0.356: JP3.2 29.21,56.44 30.33,55.33 30.33,51.58 R69.1
N$94
  Top 0.356: JP4.2 29.34,52.36 R70.1
N$95
  Top 0.356: JP5.2 29.21,60 28.09,58.88 28.09,52.9 R71.1
N$96
  Top 0.254: R99.1 LED1.A2
N$97  (via drill 0.35)
  Top 0.254: U7.20 41.86,53.55 41.37,53.06 40.41,53.06 39.88,53.59 v39.9,53.59 | R102.1 40.39,58.15 v39.88,57.64
  Route15 0.254: v39.88,57.64 v39.88,55.88
  Bottom 0.254: v39.9,53.59 39.9,55.85 v39.88,55.88
N$98  (via drill 0.35)
  Top 0.254: U7.19 42.75,54.2 42.52,53.97 40.53,53.97 40.11,54.39 40.11,54.83 40.64,55.36 v40.64,55.88 | R103.1 42.16,58.93 v40.89,57.66
  Route15 0.254: v40.89,57.66 40.89,56.13 v40.64,55.88
N$99
  Top 0.254: R104.1 45.47,56.57 45.05,56.15 U7.16
N$100
  Top 0.254: R105.1 43.69,61.96 43.97,61.69 43.97,61.25 43.51,60.79 43.51,57.56 U7.15
N$101
  Top 0.356: R85.1 60.97,48.35 U7.1
N$102
  Top 0.356: R86.1 44.27,47.74 U7.28
N$103
  Top 0.356: C88.+ 45.47,44.2 45.47,49.96 45.12,50.3 U7.25
N$104
  Top 0.356: C89.+ 36.83,51.31 40.55,51.31 C91.2 40.94,51.6 U7.23 | U7.17 42.88,55.5 C90.2
  Top 0.762: C90.2 41.15,56.48 40.97,56.66 37.63,56.66 C92.+
  Top 1.016: 36.83,51.31 37.25,51.73 L4.2 36.83,54.01 C92.+
N$105
  Top 0.356: U7.7 51.92,52.25 52.12,52.05 55.57,52.05 58.67,55.15 R75.2
N$106
  Top 0.356: R76.2 60.45,56.25 55.77,51.57 51.92,51.57 51.89,51.6 U7.6
N$107
  Top 0.356: U7.11 52.31,54.85 53.09,55.63 53.09,62.48 53.41,62.81 53.97,62.81 54.82,63.67 R77.2
N$108
  Top 0.356: U7.8 51.95,52.9 52.32,52.53 55.37,52.53 56.9,54.06 R78.2
N$109
  Top 0.356: R79.2 62.23,57.34 55.84,50.95 U7.5
N$110
  Top 0.356: R80.2 59.84,49 U7.2
N$111
  Top 0.356: U7.3 55.63,49.65 55.9,49.65 58.71,49.65 R81.2
N$112
  Top 0.356: R82.2 57.58,50.3 U7.4
N$113
  Top 0.356: R80.1 66.99,54.46 67.47,54.46 68.05,55.04 68.05,57.23 67.06,58.22 JP8.2
N$114
  Top 0.356: R81.1 62.99,52.07 63.22,52.07 63.5,52.07 67.06,55.63 JP9.2
N$115
  Top 0.356: R82.1 63.44,54.46 64.93,54.46 66.06,55.6 66.06,60.53 67.06,61.52 JP10.2
N$116
  Top 0.356: JP7.2 49.88,56.8 U7.14
N$117
  Top 0.356: U7.12 51.95,55.5 52.58,56.13 52.58,62.9 R83.2
N$118
  Top 0.356: R84.2 51.94,63.28 51.94,56.52 51.58,56.15 U7.13
N$119
  Top 0.254: R100.1 LED1.A3
N$120
  Top 0.254: LED1.A1 R98.1
N$121
  Top 0.254: U$1.LED+ 13.48,82.4 R101.2
NRST  (via drill 0.25)
  Top 0.254: R53.1 C71.1 91.08,98.03 89.5,98.03 88.91,97.44 88.91,96.61 89.5,96.03 90.54,96.03 TC1.10 91.19,93.22 v92.96,91.44 | U3.25 90.22,64.06 v90.42,64.26
  Bottom 0.254: v92.96,91.44 92.96,66.8 v90.42,64.26
OSC_IN
  Top 0.254: U3.23 77.9,65.06 Y1.1 72.01,67.01 C73.1
OSC_OUT
  Top 0.254: U3.24 78.99,64.56 Y1.2 72,61.51 C74.2
PUSHBTN  (via drill 0.25)
  Top 0.254: v91.95,86.61 78.99,99.57 33.81,99.57 16.93,82.69 C102.1 12.17,79.25 U$1.P$5 U$1.P$2 | v94.74,86.61 98.04,86.61 102.78,81.88 U3.115
  Route15 0.254: v91.95,86.61 v94.74,86.61
SAI_BCK  (via drill 0.35)
  Top 0.356: R90.2 59.69,70.36 | R75.1 v58.67,67.06 | v58.93,69.6 59.69,70.36 | v29.46,70.36 27.34,70.36 R63.1 | 59.69,70.36 53.59,70.36 | 53.59,70.36 v32.26,70.36 | TP9.TP 53.59,70.36
  Bottom 0.356: v58.67,67.06 58.67,69.34 v58.93,69.6 | v32.26,70.36 v29.46,70.36
SAI_DATA1  (via drill 0.35)
  Top 0.356: R91.2 48.77,68.58 | 48.77,68.58 v30.23,68.58 | v27.94,68.58 25.45,66.09 25.16,66.09 24.3,65.24 R64.1 | TP10.TP 48.77,68.58
  Bottom 0.356: v30.23,68.58 v27.94,68.58
SAI_DATA2  (via drill 0.35)
  Top 0.356: R88.2 67.98,73.66 61.72,73.66 TP7.TP | R76.1 v60.45,67.06
  Bottom 0.356: TP7.TP 60.45,73.41 v60.45,67.06
SAI_LRCK  (via drill 0.35)
  Top 0.356: R78.1 v56.9,67.06 | v31.5,72.14 27.34,72.14 R66.1 | R89.2 57.4,72.14 TP8.TP 54.47,72.39 54.37,72.49 34.14,72.49 v33.78,72.14
  Bottom 0.356: v56.9,67.06 56.9,71.12 57.15,71.37 TP8.TP | v33.78,72.14 v31.5,72.14
SAI_MCLK  (via drill 0.35)
  Top 0.356: R79.1 v62.23,66.8 | R67.1 36.59,76.05 61.99,76.05 63.25,74.79 | 63.25,74.79 v63.25,74.68 | R87.2 TP6.TP 65.02,75.18 63.64,75.18 63.25,74.79
  Bottom 0.356: v63.25,74.68 63.25,67.82 v62.23,66.8
SPI_CLK
  Top 0.254: U3.41 90.28,51.42 90.03,51.17 IC7.2 80.47,51.17 79.69,51.95 78.34,51.95 77.27,53.02 77.27,54.1 76.2,55.17 74.68,55.17 74.38,54.86 70.87,54.86 JP9.1
  Top 0.356: JP4.1 31.88,48.13 TP13.TP
  Route15 0.254: JP9.1 67.69,54.23 41.26,54.23 41.11,54.08 40.67,54.08 40.52,54.23 JP4.1
SPI_CS_DAC1  (via drill 0.35)
  Top 0.254: U3.37 88.28,56.27 v87.38,55.37
  Route15 0.254: JP3.1 28.88,55.19 67.44,55.19 68.66,56.41 68.66,56.52 69.21,57.07 70.18,57.07 v71.63,55.63
  Bottom 0.254: v87.38,55.37 71.88,55.37 v71.63,55.63
  Bottom 0.356: TP11.TP 26.31,62.38 26.26,62.38 25.68,61.8 25.68,59.61 26.67,58.62 JP3.1
SPI_CS_DAC2  (via drill 0.35)
  Top 0.254: v87.63,56.64 87.85,56.86 87.85,57.46 88.04,57.66 89.52,57.66 89.71,57.46 89.71,56.75 U3.40
  Top 0.356: TP12.TP 65.02,64.06 65.51,63.58 65.51,60.43 JP8.1
  Route15 0.254: JP8.1 65.73,59.44 66.67,60.38 70.18,60.38 v74.17,56.39
  Bottom 0.254: v87.63,56.64 86.87,55.88 74.68,55.88 v74.17,56.39
SPI_CS_FLASH
  Top 0.254: U3.44 91.71,56.75 91.71,57.46 91.13,58.04 87.88,58.04 86.84,57 86.84,54.6 IC7.4
SPI_MISO
  Top 0.254: U3.42 90.78,51.15 90.17,50.55 79.78,50.55 IC7.8 78.12,49.91 76.69,51.34 76.69,52.09 TP14.TP
SPI_MOSI
  Top 0.254: JP10.1 70.54,61.54 70.54,58.36 69.93,57.76 69.21,57.76 68.66,57.21 68.66,55.06 74.31,49.41 79.95,49.41 80.45,49.91 IC7.1 90.07,49.91 91.28,51.12 U3.43 | TP15.TP 32.51,61.47 JP5.1
  Route15 0.254: JP5.1 66.46,60.71 66.51,60.76 67.87,60.76 JP10.1
SWCLK
  Top 0.254: U3.109 105.78,84.33 105.78,84.47 105.78,84.59 TC1.4
SWDIO
  Top 0.254: TC1.2 106.43,85.22 106.43,76.71 106.43,76.45 106.43,74.93 106.8,74.56 U3.105
SWO
  Top 0.254: TC1.6 93.73,77.99 U3.133
UART_RX  (via drill 0.35)
  Top 0.254: U3.122 99.21,78 99.21,78.71 97.03,80.9 97.03,82.29 94.23,85.08 94.23,85.09 v94.26,85.09 | v92.46,94.23 TC1.8
  Bottom 0.254: v94.26,85.09 93.45,85.9 93.45,91.64 92.46,92.63 v92.46,94.23
UART_TX  (via drill 0.35)
  Top 0.254: U3.119 100.78,79.55 101.06,79.83 101.06,82.56 100.38,83.24 98.87,83.24 98.77,83.33 97.77,83.33 v95.5,85.6 | v92.96,97.54 92.46,97.03 TC1.7
  Bottom 0.254: v92.96,97.54 94.26,96.24 94.26,86.41 95.08,85.6 v95.5,85.6
USB_DEV_CONN_N
  Top 0.152: USB_FS.2 108.95,90.65 108.46,91.13 107.95,90.63 107.95,88.9 108.46,88.39 113.41,88.39 114.1,87.7 114.1,86.61 114.77,85.94 R61.2
  Top 0.356: R61.2 115.06,85.99
USB_DEV_CONN_P
  Top 0.152: USB_FS.3 108.95,91.93 108.46,91.44 108.33,91.44 107.64,90.75 107.64,88.77 108.33,88.09 113.28,88.09 113.79,87.58 113.79,86.61 113.17,85.99 113.03,85.99
  Top 0.356: 113.03,85.99 R62.2
USB_DEV_N
  Top 0.152: U4.4 115,84.17
  Top 0.356: 115,84.17 R61.1
USB_DEV_P
  Top 0.152: U4.6 113.1,84.17
  Top 0.356: 113.1,84.17 R62.1
USB_FS_N
  Top 0.152: U4.3 115,78.41 114.2,77.61 114.2,75.16 112.65,73.61 107.7,73.61 U3.103
USB_FS_P
  Top 0.152: U4.1 113.1,78.41 113.89,77.61 113.89,75.29 112.52,73.91 108.47,73.91 108.42,73.97 107.75,73.97 U3.104
USB_HOST_CONN_N
  Top 0.152: USB_HS.P$2 125.22,90.17 125.73,89.66 125.91,89.66 126.7,88.87 126.7,84.11 125.69,83.1 125.69,82.84 126.4,82.13 R59.2
USB_HOST_CONN_P
  Top 0.152: USB_HS.P$3 125.22,88.65 125.73,89.15 125.98,89.15 126.4,88.74 126.4,84.23 124.97,82.8 124.97,82.38
  Top 0.356: 124.97,82.38 R60.2
USB_HOST_N
  Top 0.152: U5.4 126.68,80.24 R59.1
USB_HOST_P
  Top 0.152: R60.1 124.78,80.36 U5.6
  Top 0.229: 124.87,80.43 R60.1
USB_HS_N
  Top 0.152: U5.3 126.68,75.07 125.91,74.3 125.91,69.39 123.06,66.55 119.3,66.55 113.41,60.66 108.46,60.66 108.36,60.56 U3.77
  Top 0.229: U5.3 126.68,75.44
USB_HS_P
  Top 0.152: 124.78,75.69 124.78,75.25 125.6,74.42 125.6,69.52 122.94,66.85 119.18,66.85 113.28,60.96 108.46,60.96 108.36,61.06 U3.78
  Top 0.229: 124.78,75.37 124.78,75.69 U5.1

## Text on the board
tNames: DT Breakout Box | Rev A, Nov 2020 | Designed by: | Eran Rundstein | Pulsar Heavy Industries